# EAGLE board Compute Module (EAGLE 9.6.2), part 1 of 2
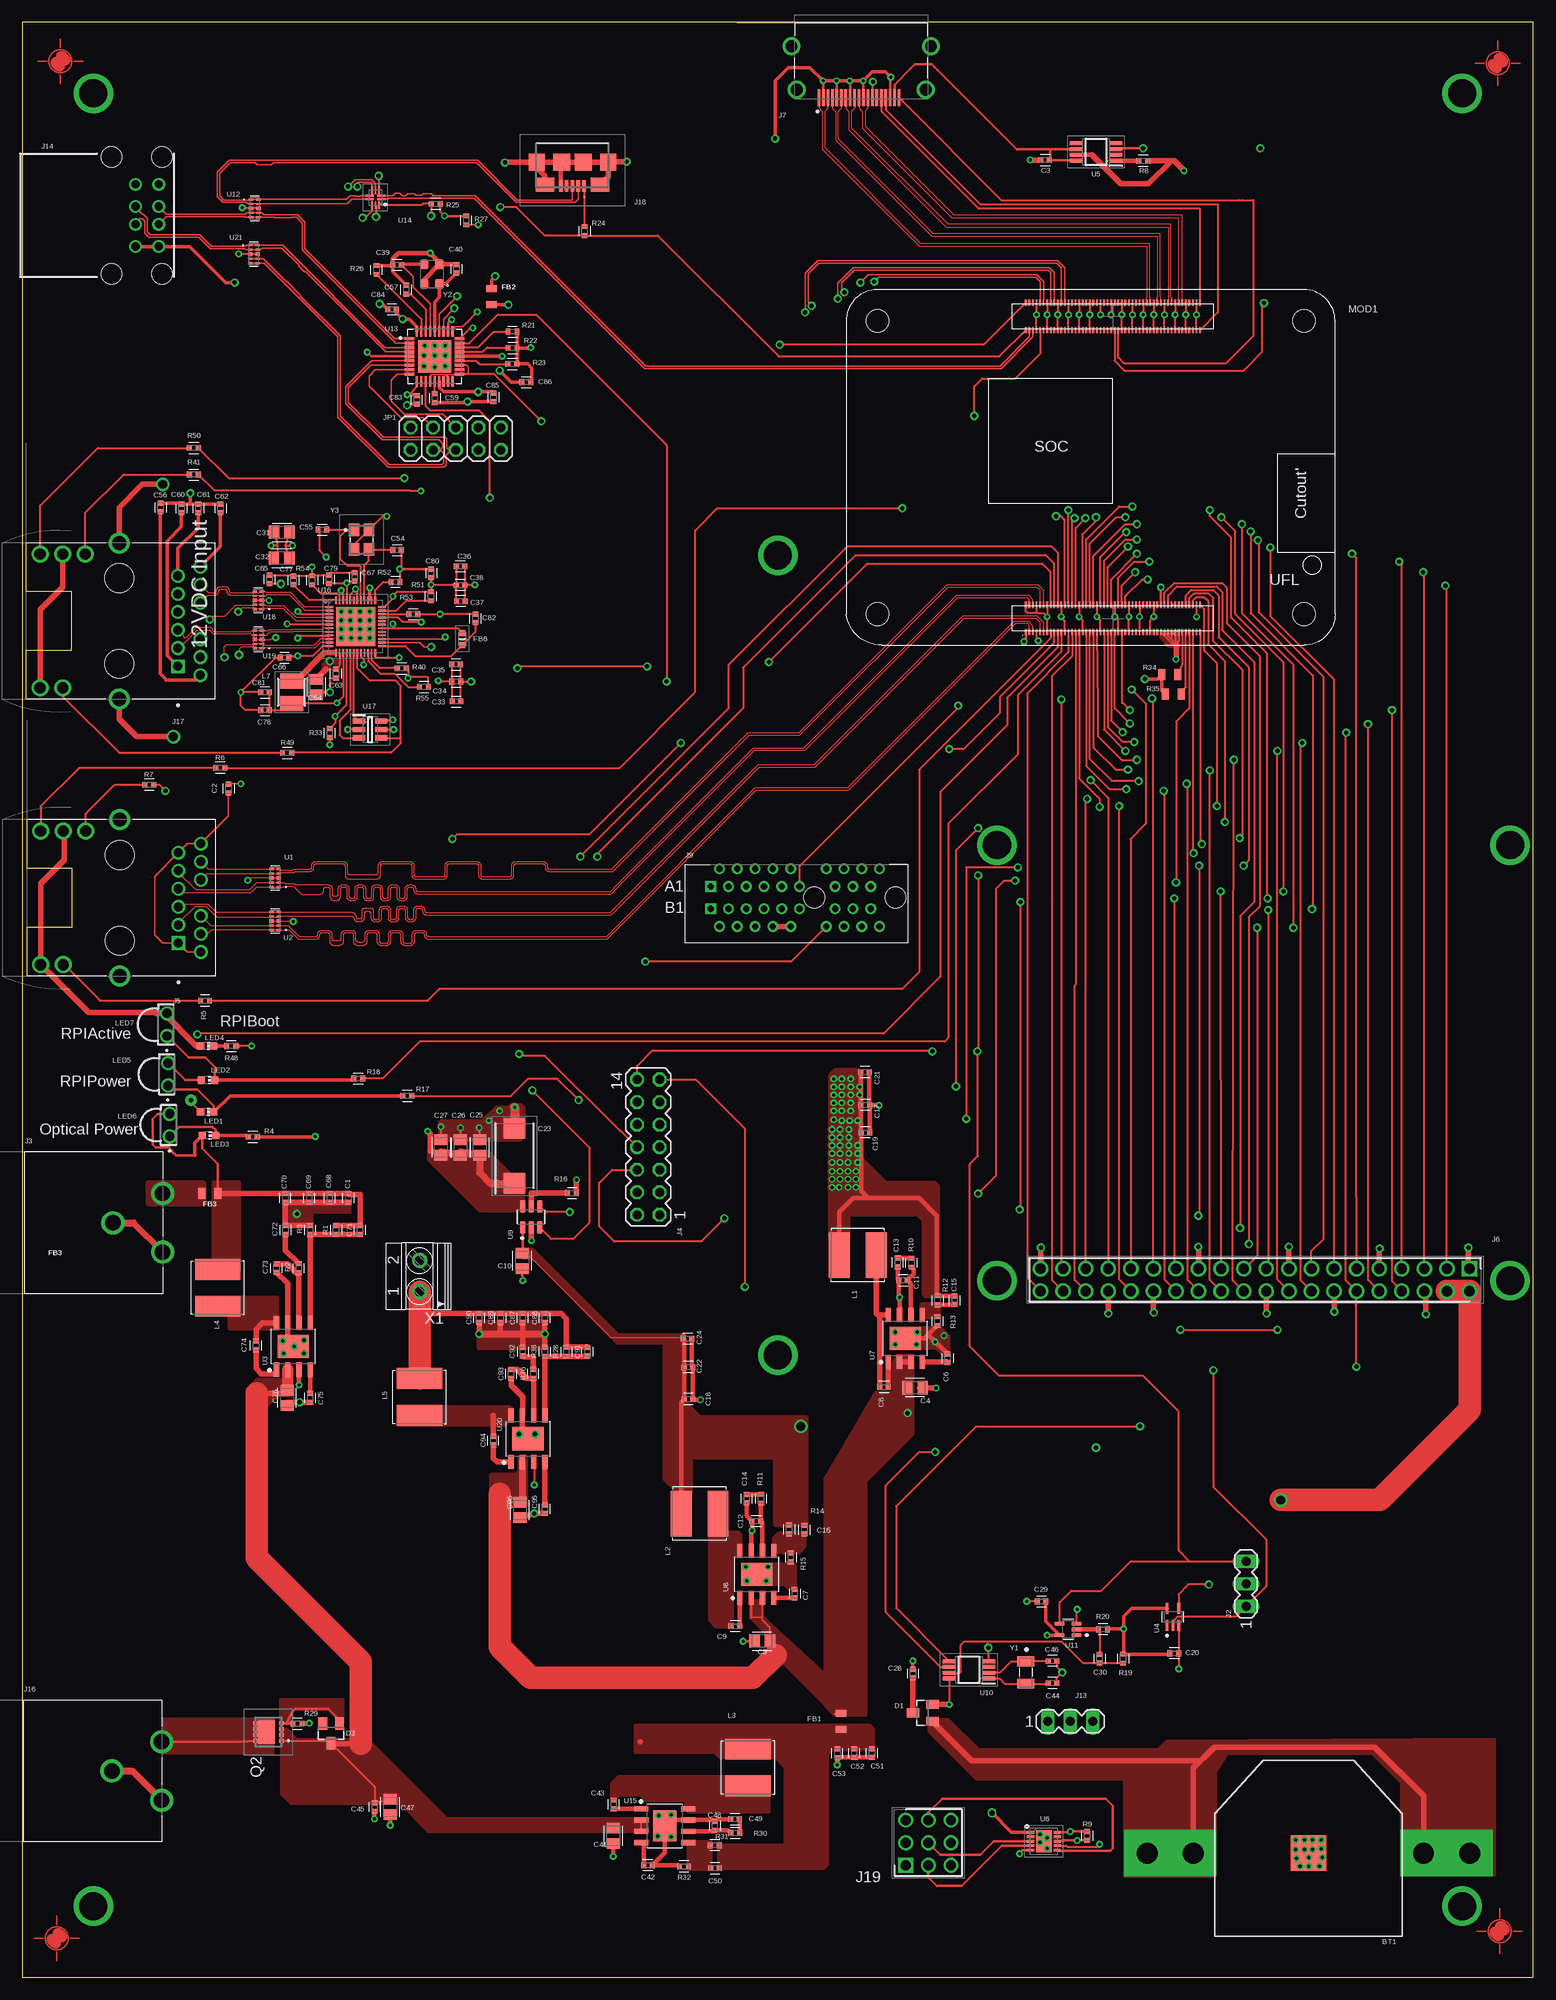
[diagram p11: board, top side]
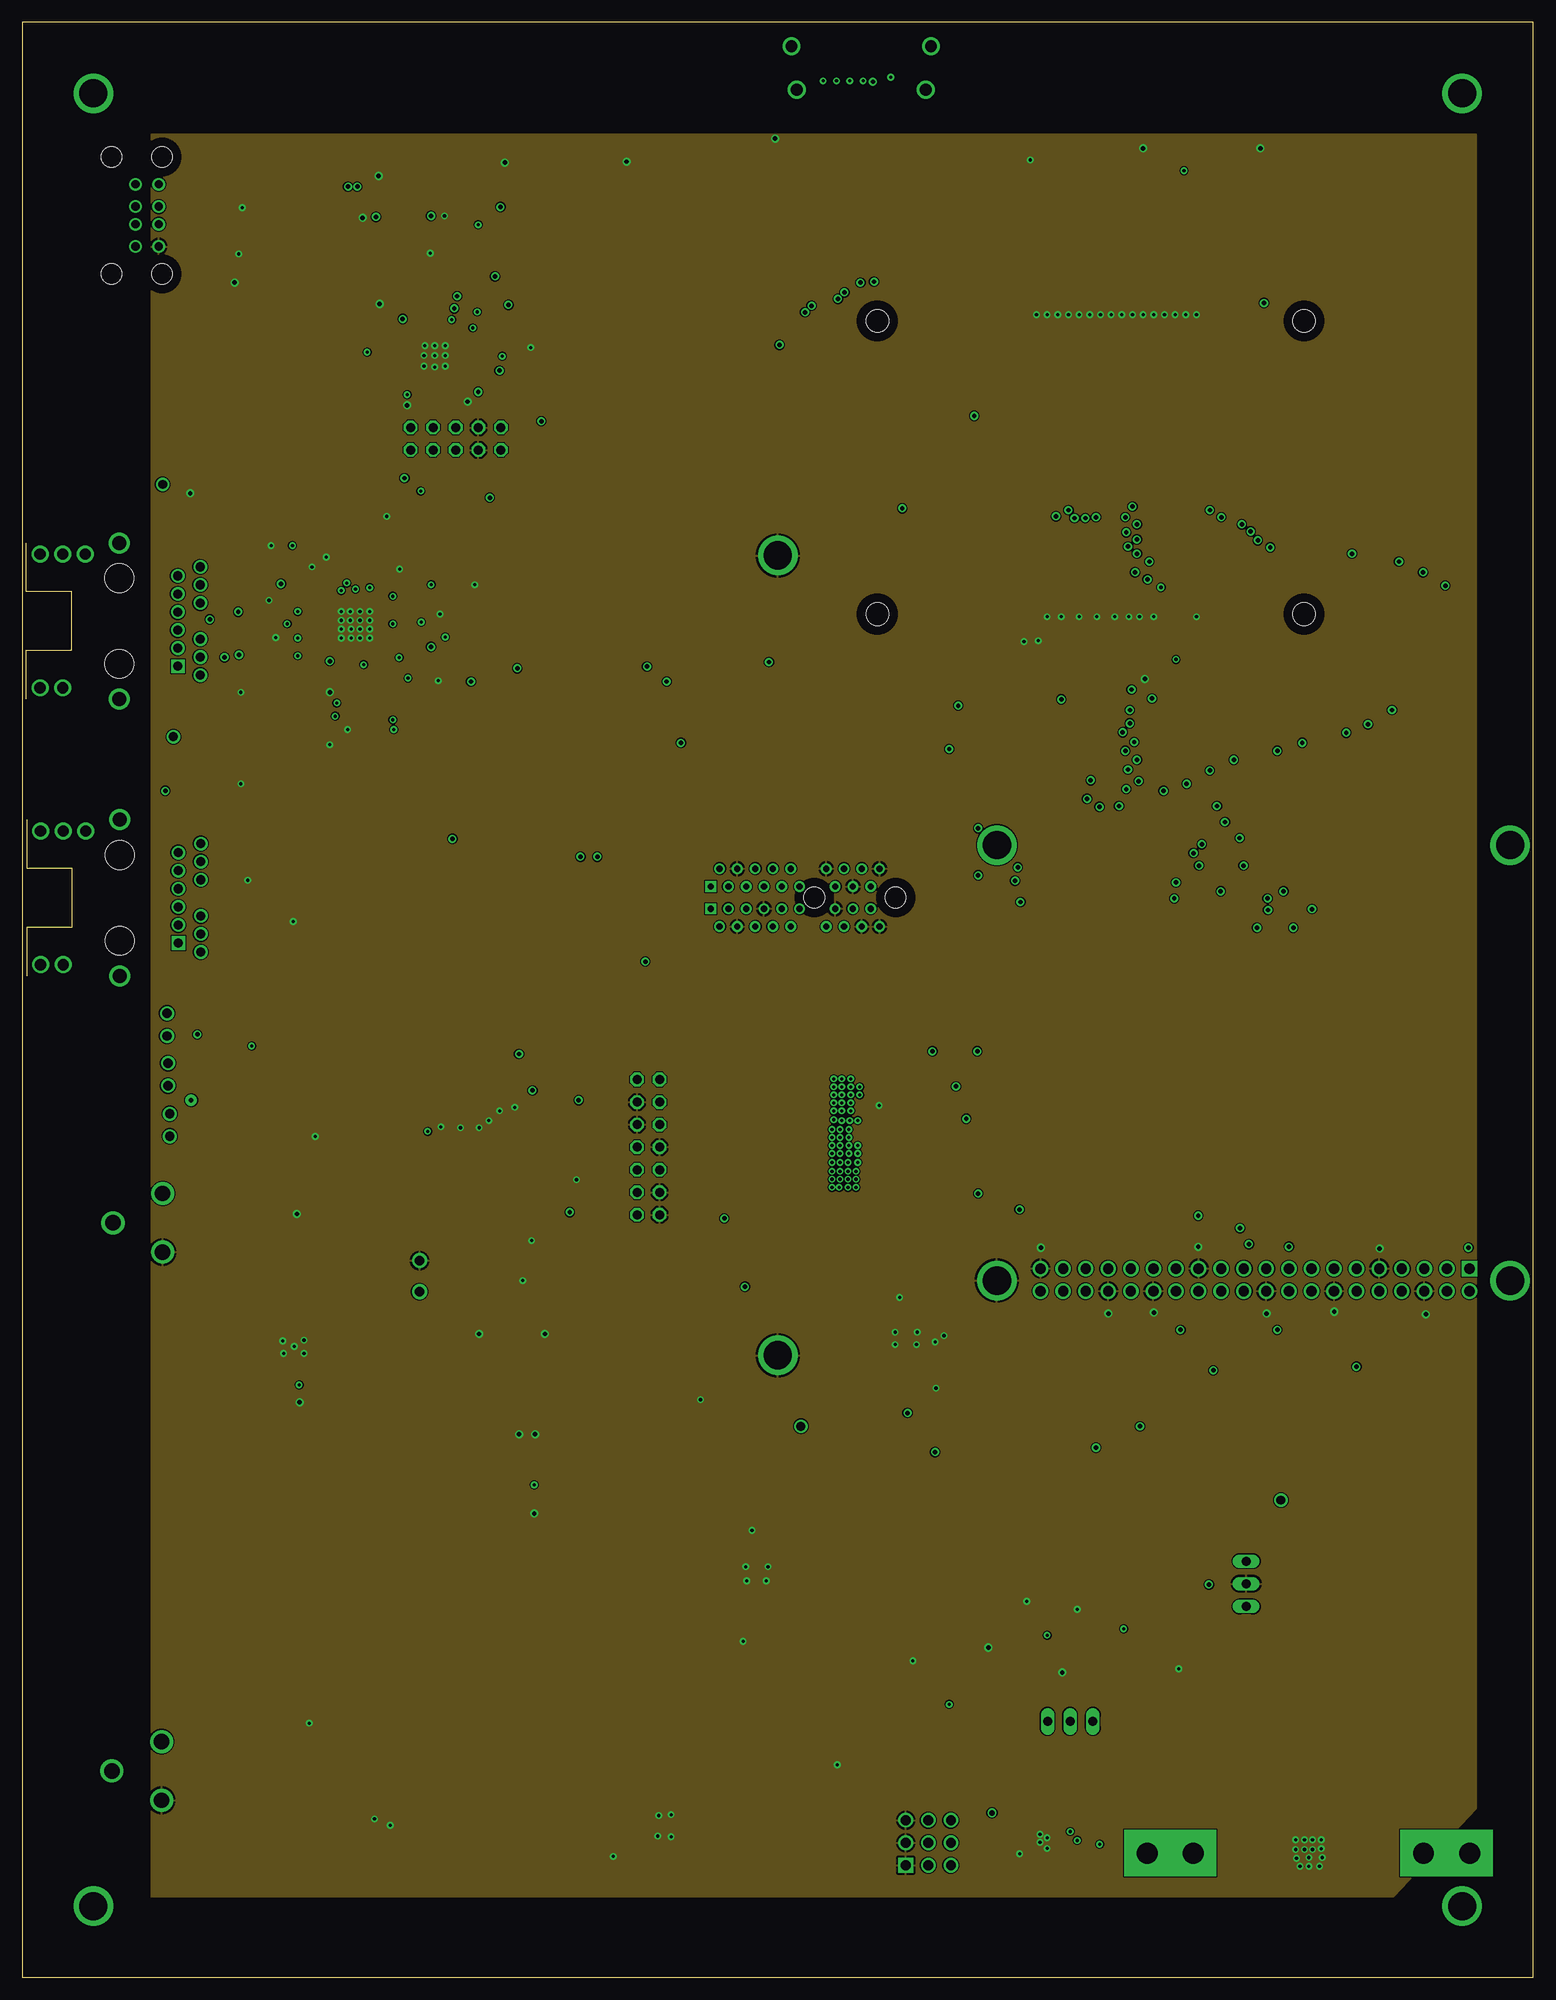
[diagram p12: board, inner layer GND]
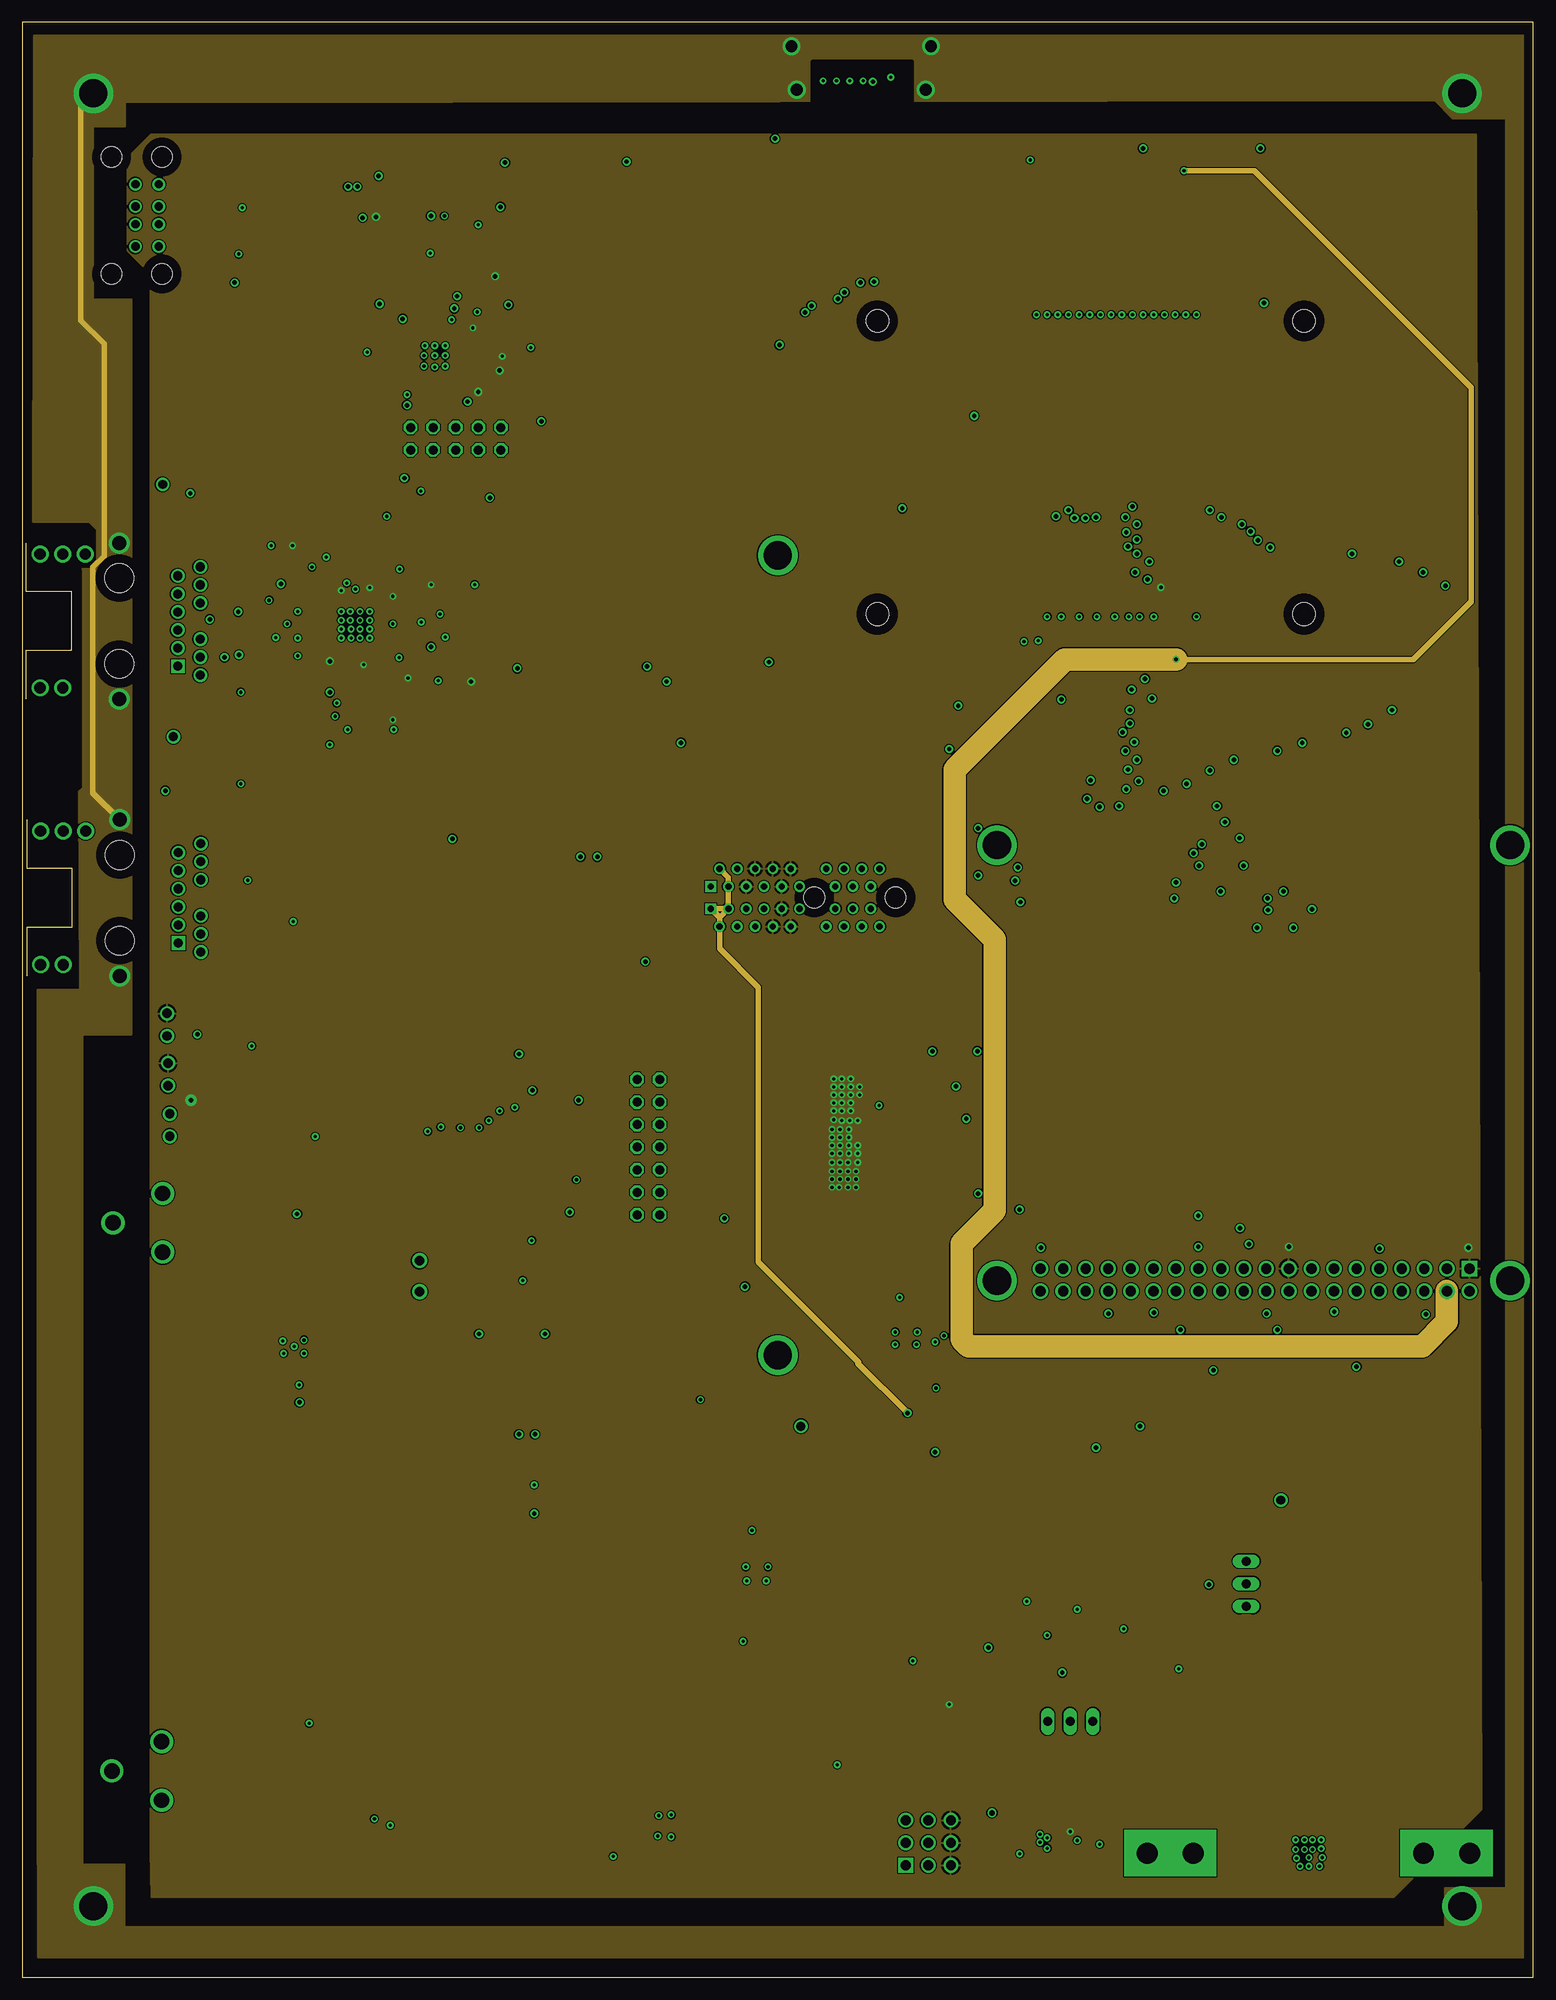
[diagram p13: board, inner layer 3v3]
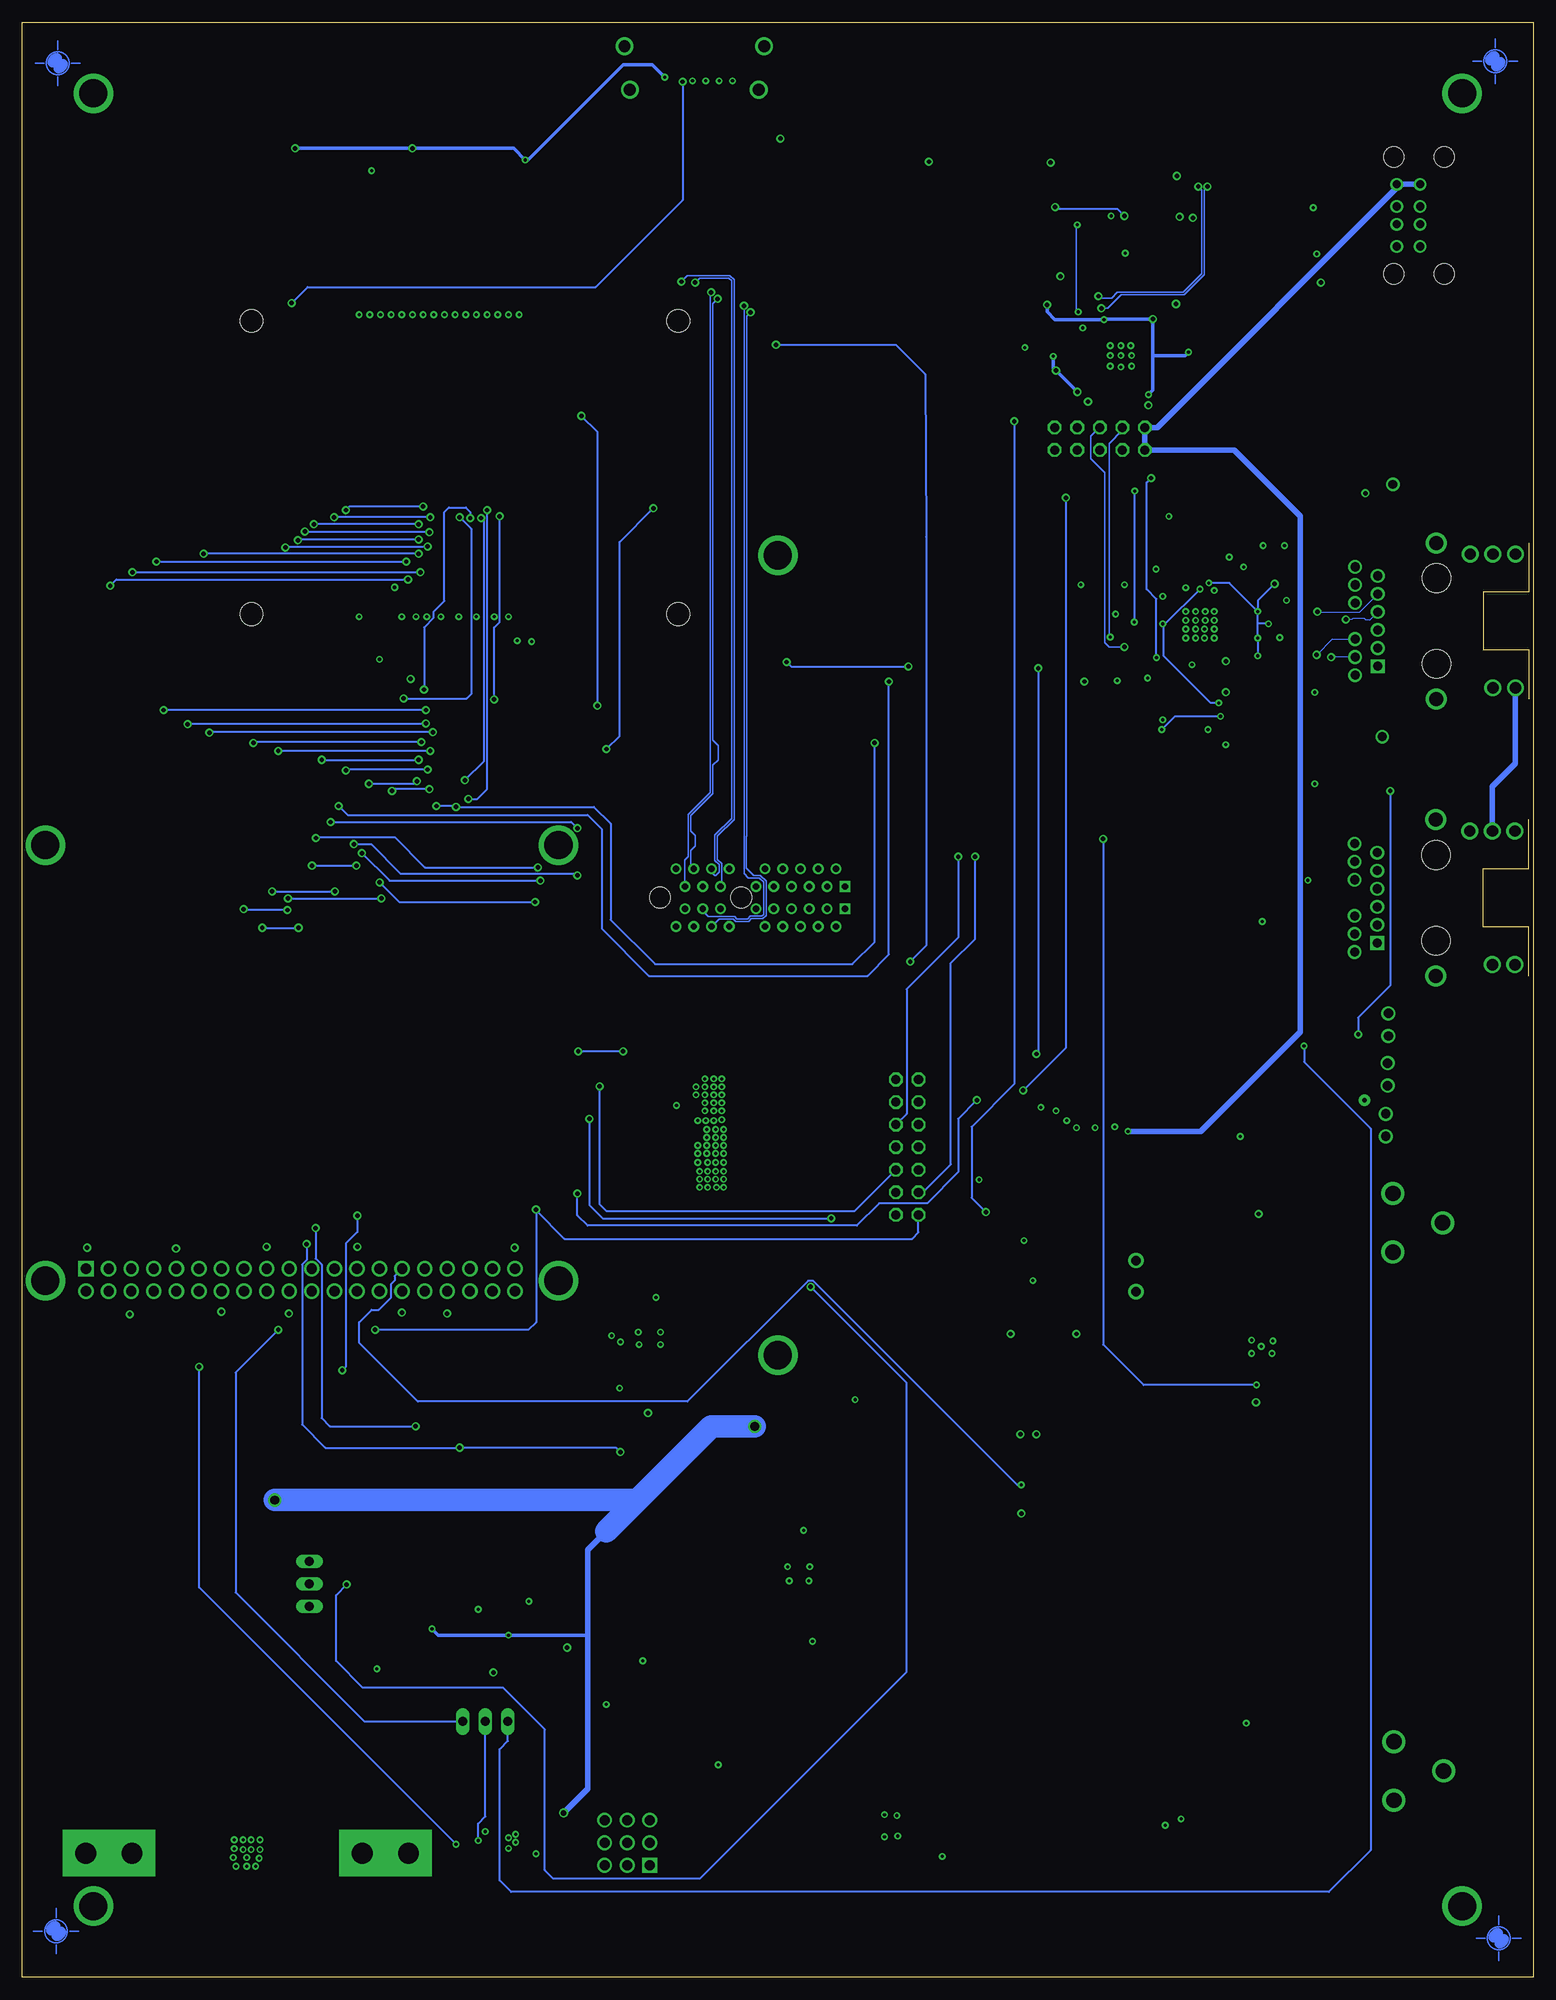
[diagram p14: board, bottom side, seen from below]

Size 170 x 220 mm. Coordinates in mm from the lower left corner, seen from the top.
Outline: 0,0 170,0 170,220 0,220 0,0
Copper layers (1*2+15*16): Top 0.035mm / dielectric 0.09mm / GND 0.035mm / dielectric 1.26mm / 3v3 0.035mm / dielectric 0.09mm / Bottom 0.035mm
Design rules "default *": minimum track width 5mil, minimum drill 0.35mm, track to track 5mil, track to pad 5mil, pad to pad 5mil, via to via 5mil, smd to smd 5mil, copper to edge 40mil, drill to drill 5mil, minimum pad ring 10mil, minimum via ring 8mil, stop-mask expansion 2mil, vias tented up to drill 0mil, thermal gap 10mil
Net classes: 1 Ethernet 100: width 0.127 mm, clearance 0.13 mm; 2 USB 90: width 0.147 mm, clearance 0.13 mm; 3 PCI 90: width 0.147 mm, clearance 0.13 mm; 4 HDMI 100: width 0.127 mm, clearance 0.13 mm

## Footprints (pad centres in the part's own frame; a part is rotated, then mirrored left to right if it is on the bottom)
EDGE-LIBRARY_79523141 = smd 4 x 4: N 0,0 | drill 2.35 pad 5.2 square: P1 -12.95,0; P2 12.95,0; P3 18.15,0; P4 -18.15,0
EDGE-LIBRARY_TUTORIAL---FUSION-360_CAPC1005X60 = smd 0.56 x 0.629: 1 -0.485,0; 2 0.485,0
EDGE-LIBRARY_TUTORIAL---FUSION-360_CAPC2012X110 = smd 1.165 x 1.465: 1 -0.875,0; 2 0.875,0
CAPPM7343X200N = smd 2.3 x 2.45: 1 -3.1,0; 2 3.1,0
EDGE-LIBRARY_SOT23 = smd 1 x 1.4: 1 -0.95,-1.1; 2 0.95,-1.1; 3 0,1.1
EDGE-LIBRARY_0805 = smd 0.8 x 1.2: 1 -0.9,0; 2 0.9,0
SAMACSYS_PARTS_BLM18AG102BH1D = smd 0.65 x 0.7: 1 -0.675,0; 2 0.675,0
CON-LSTB_MA03-1 = drill 1.016 long: 1 -2.54,0; 2 0,0; 3 2.54,0
L712RAS_SWITCHCRAFT_L712RAS = drill 1.727: C 0,3.302; S -5.588,0; SS 0,-3.302
CON-LSTB_MA07-2 = drill 1.016 octagon: 1 -7.62,-1.27; 2 -7.62,1.27; 3 -5.08,-1.27; 4 -5.08,1.27; 5 -2.54,-1.27; 6 -2.54,1.27; 7 0,-1.27; 8 0,1.27; 9 2.54,-1.27; 10 2.54,1.27; 11 5.08,-1.27; 12 5.08,1.27; 13 7.62,-1.27; 14 7.62,1.27
EDGE-LIBRARY_L836-1J1T-43_BEL_L836-1J1T-43 = drill 1.02 square: 1 -5.08,-6.604 | drill 1.02: 2 -3.048,-6.604; 3 -1.016,-6.604; 4 1.016,-6.604; 5 3.048,-6.604; 6 5.08,-6.604; 7 -6.096,-9.144; 8 -4.064,-9.144; 9 -2.032,-9.144; 10 2.032,-9.144; 11 4.064,-9.144; 12 6.096,-9.144 | drill 1.27: 13 -7.518,6.35; 14 -7.518,8.89; 15 7.518,3.81; 16 7.518,6.35; 17 7.518,8.89 | drill 1.57: S1 -8.788,0; S2 8.788,0 | hole 3.251: -4.826,0; 4.826,0
HDRV40W67P254_2X20_5080X483X85 = drill 1.15 pad 1.725 square: 1 0,0 | drill 1.15 pad 1.725: 2 0,2.54; 3 2.54,0; 4 2.54,2.54; 5 5.08,0; 6 5.08,2.54; 7 7.62,0; 8 7.62,2.54; 9 10.16,0; 10 10.16,2.54; 11 12.7,0; 12 12.7,2.54; 13 15.24,0; 14 15.24,2.54; 15 17.78,0; 16 17.78,2.54; 17 20.32,0; 18 20.32,2.54; 19 22.86,0; 20 22.86,2.54; 21 25.4,0; 22 25.4,2.54; 23 27.94,0; 24 27.94,2.54; 25 30.48,0; 26 30.48,2.54; 27 33.02,0; 28 33.02,2.54; 29 35.56,0; 30 35.56,2.54; 31 38.1,0; 32 38.1,2.54; 33 40.64,0; 34 40.64,2.54; 35 43.18,0; 36 43.18,2.54; 37 45.72,0; 38 45.72,2.54; 39 48.26,0; 40 48.26,2.54
EDGE-LIBRARY_STEWART_SS-53000-001 = smd 0.3 x 1.9: 1 4.75,0; 2 4.25,0; 3 3.75,0; 4 3.25,0; 5 2.75,0; 6 2.25,0; 7 1.75,0; 8 1.25,0; 9 0.75,0; 10 0.25,0; 11 -0.25,0; 12 -0.75,0; 13 -1.25,0; 14 -1.75,0; 15 -2.25,0; 16 -2.75,0; 17 -3.25,0; 18 -3.75,0; 19 -4.25,0 | drill 1.33: S1 7.25,-0.9; S2 -7.25,-0.9; S3 -7.85,-5.8; S4 7.85,-5.8
EDGE-LIBRARY_AMPHENOL_10018784-10210TLF = drill 0.7 square: A1 -11.65,1.25; B1 -11.65,-1.25 | drill 0.7: A2 -10.65,3.25; A3 -9.65,1.25; A4 -8.65,3.25; A5 -7.65,1.25; A6 -6.65,3.25; A7 -5.65,1.25; A8 -4.65,3.25; A9 -3.65,1.25; A10 -2.65,3.25; A11 -1.65,1.25; A12 1.35,3.25; A13 2.35,1.25; A14 3.35,3.25; A15 4.35,1.25; A16 5.35,3.25; A17 6.35,1.25; A18 7.35,3.25; B2 -10.65,-3.25; B3 -9.65,-1.25; B4 -8.65,-3.25; B5 -7.65,-1.25; B6 -6.65,-3.25; B7 -5.65,-1.25; B8 -4.65,-3.25; B9 -3.65,-1.25; B10 -2.65,-3.25; B11 -1.65,-1.25; B12 1.35,-3.25; B13 2.35,-1.25; B14 3.35,-3.25; B15 4.35,-1.25; B16 5.35,-3.25; B17 6.35,-1.25; B18 7.35,-3.25 | hole 2.35: 0,0; 9.15,0
EDGE-LIBRARY_67298-4090_MOLEX_67298-4090 = drill 0.92: 1 -3.5,5.33; 2 -1,5.33; 3 1,5.33; 4 3.5,5.33; 5 -3.5,2.71; 6 -1,2.71; 7 1,2.71; 8 3.5,2.71 | hole 2.3: -6.57,5.68; -6.57,0; 6.57,5.68; 6.57,0
ZX62B5PA33 = smd 0.4 x 1.35: 1 -1.3,2.325; 2 -0.65,2.325; 3 0,2.325; 4 0.65,2.325; 5 1.3,2.325 | smd 1.8 x 1.9: MP1 -4,-0.35; MP2 4,-0.35 | smd 2.1 x 1.6: MP3 -3.1,2.2; MP4 3.1,2.2 | smd 1.9 x 1.9: MP5 -1.2,-0.35; MP6 1.2,-0.35
HDRV9W64P254_3X3_762X749X838P = drill 1.1 pad 1.65 square: 1 0,0 | drill 1.1 pad 1.65: 2 0,2.54; 3 0,5.08; 4 2.54,0; 5 2.54,2.54; 6 2.54,5.08; 7 5.08,0; 8 5.08,2.54; 9 5.08,5.08
2X05 = drill 1.016 octagon: 1 -5.08,-1.27; 2 -5.08,1.27; 3 -2.54,-1.27; 4 -2.54,1.27; 5 0,-1.27; 6 0,1.27; 7 2.54,-1.27; 8 2.54,1.27; 9 5.08,-1.27; 10 5.08,1.27
EDGE-LIBRARY_SRN6045TA-3R3Y_IND_SRN6045TA-3R3Y = smd 2.35 x 5.1: 1 -2.075,0; 2 2.075,0
INDPM3030X150N = smd 1.7 x 2.6: 1 -1.25,0; 2 1.25,0
LED_CHIP-LED0603 = smd 0.8 x 0.8: A 0,-0.75; C 0,0.75
TLPP5600 = drill 1.05 pad 1.55: 1 1.27,-0.7; 2 -1.27,-0.7
BEAGLEBONEBLACK_MOUNTING_HOLE = drill 3.175 pad 4.445: P$1 0,0
EDGE-LIBRARY_RPI-CM4 = smd 0.2 x 0.7: 1 34.8,38.54; 2 34.8,35.46; 3 34.4,38.54; 4 34.4,35.46; 5 34,38.54; 6 34,35.46; 7 33.6,38.54; 8 33.6,35.46; 9 33.2,38.54; 10 33.2,35.46; 11 32.8,38.54; 12 32.8,35.46; 13 32.4,38.54; 14 32.4,35.46; 15 32,38.54; 16 32,35.46; 17 31.6,38.54; 18 31.6,35.46; 19 31.2,38.54; 20 31.2,35.46; 21 30.8,38.54; 22 30.8,35.46; 23 30.4,38.54; 24 30.4,35.46; 25 30,38.54; 26 30,35.46; 27 29.6,38.54; 28 29.6,35.46; 29 29.2,38.54; 30 29.2,35.46; 31 28.8,38.54; 32 28.8,35.46; 33 28.4,38.54; 34 28.4,35.46; 35 28,38.54; 36 28,35.46; 37 27.6,38.54; 38 27.6,35.46; 39 27.2,38.54; 40 27.2,35.46; 41 26.8,38.54; 42 26.8,35.46; 43 26.4,38.54; 44 26.4,35.46; 45 26,38.54; 46 26,35.46; 47 25.6,38.54; 48 25.6,35.46; 49 25.2,38.54; 50 25.2,35.46; 51 24.8,38.54; 52 24.8,35.46; 53 24.4,38.54; 54 24.4,35.46; 55 24,38.54; 56 24,35.46; 57 23.6,38.54; 58 23.6,35.46; 59 23.2,38.54; 60 23.2,35.46; 61 22.8,38.54; 62 22.8,35.46; 63 22.4,38.54; 64 22.4,35.46; 65 22,38.54; 66 22,35.46; 67 21.6,38.54; 68 21.6,35.46; 69 21.2,38.54; 70 21.2,35.46; 71 20.8,38.54; 72 20.8,35.46; 73 20.4,38.54; 74 20.4,35.46; 75 20,38.54; 76 20,35.46; 77 19.6,38.54; 78 19.6,35.46; 79 19.2,38.54; 80 19.2,35.46; 81 18.8,38.54; 82 18.8,35.46; 83 18.4,38.54; 84 18.4,35.46; 85 18,38.54; 86 18,35.46; 87 17.6,38.54; 88 17.6,35.46; 89 17.2,38.54; 90 17.2,35.46; 91 16.8,38.54; 92 16.8,35.46; 93 16.4,38.54; 94 16.4,35.46; 95 16,38.54; 96 16,35.46; 97 15.6,38.54; 98 15.6,35.46; 99 15.2,38.54; 100 15.2,35.46; 101 34.8,4.54; 102 34.8,1.46; 103 34.4,4.54; 104 34.4,1.46; 105 34,4.54; 106 34,1.46; 107 33.6,4.54; 108 33.6,1.46; 109 33.2,4.54; 110 33.2,1.46; 111 32.8,4.54; 112 32.8,1.46; 113 32.4,4.54; 114 32.4,1.46; 115 32,4.54; 116 32,1.46; 117 31.6,4.54; 118 31.6,1.46; 119 31.2,4.54; 120 31.2,1.46; 121 30.8,4.54; 122 30.8,1.46; 123 30.4,4.54; 124 30.4,1.46; 125 30,4.54; 126 30,1.46; 127 29.6,4.54; 128 29.6,1.46; 129 29.2,4.54; 130 29.2,1.46; 131 28.8,4.54; 132 28.8,1.46; 133 28.4,4.54; 134 28.4,1.46; 135 28,4.54; 136 28,1.46; 137 27.6,4.54; 138 27.6,1.46; 139 27.2,4.54; 140 27.2,1.46; 141 26.8,4.54; 142 26.8,1.46; 143 26.4,4.54; 144 26.4,1.46; 145 26,4.54; 146 26,1.46; 147 25.6,4.54; 148 25.6,1.46; 149 25.2,4.54; 150 25.2,1.46; 151 24.8,4.54; 152 24.8,1.46; 153 24.4,4.54; 154 24.4,1.46; 155 24,4.54; 156 24,1.46; 157 23.6,4.54; 158 23.6,1.46; 159 23.2,4.54; 160 23.2,1.46; 161 22.8,4.54; 162 22.8,1.46; 163 22.4,4.54; 164 22.4,1.46; 165 22,4.54; 166 22,1.46; 167 21.6,4.54; 168 21.6,1.46; 169 21.2,4.54; 170 21.2,1.46; 171 20.8,4.54; 172 20.8,1.46; 173 20.4,4.54; 174 20.4,1.46; 175 20,4.54; 176 20,1.46; 177 19.6,4.54; 178 19.6,1.46; 179 19.2,4.54; 180 19.2,1.46; 181 18.8,4.54; 182 18.8,1.46; 183 18.4,4.54; 184 18.4,1.46; 185 18,4.54; 186 18,1.46; 187 17.6,4.54; 188 17.6,1.46; 189 17.2,4.54; 190 17.2,1.46; 191 16.8,4.54; 192 16.8,1.46; 193 16.4,4.54; 194 16.4,1.46; 195 16,4.54; 196 16,1.46; 197 15.6,4.54; 198 15.6,1.46; 199 15.2,4.54; 200 15.2,1.46 | hole 2.55: 3.5,3.5; 3.5,36.5; 51.5,36.5; 51.5,3.5
RQ3E100ATTB = smd 0.47 x 0.5: 1 -0.975,-1.45; 2 -0.325,-1.45; 3 0.325,-1.45; 4 0.975,-1.45 | smd 0.47 x 0.55: 5 0.975,1.425; 6 0.325,1.425; 7 -0.325,1.425; 8 -0.975,1.425 | smd 2.7 x 1.85: 9 0,0.225
EDGE-LIBRARY_TUTORIAL---FUSION-360_RESC1005X40 = smd 0.535 x 0.644: 1 -0.507,0; 2 0.507,0
EDGE-LIBRARY_TPD4EUSB30DQAR_IC_TPD4EUSB30DQAR = smd 0.565 x 0.2: 1 -0.417,1; 2 -0.417,0.5; 4 -0.417,-0.5; 5 -0.417,-1; 6 0.417,-1; 7 0.417,-0.5; 9 0.417,0.5; 10 0.417,1 | smd 0.565 x 0.4: 3 -0.417,0; 8 0.417,0
EDGE-LIBRARY_AP64501_SOIC127P600X265-9T261X350N = smd 1.58 x 0.589: 1 -2.625,1.905; 2 -2.625,0.635; 3 -2.625,-0.635; 4 -2.625,-1.905; 5 2.625,-1.905; 6 2.625,-0.635; 7 2.625,0.635; 8 2.625,1.905 | smd 2.613 x 3.502: 9 0,0
EDGE-LIBRARY_SOT65P210X110-5N = smd 1.19 x 0.4: 1 -0.96,0.65; 2 -0.96,0; 3 -0.96,-0.65; 4 0.96,-0.65; 5 0.96,0.65
SOP65P490X110-8N = smd 1.45 x 0.45: 1 -2.225,0.975; 2 -2.225,0.325; 3 -2.225,-0.325; 4 -2.225,-0.975; 5 2.225,-0.975; 6 2.225,-0.325; 7 2.225,0.325; 8 2.225,0.975
SAMACSYS_PARTS_SON50P300X300X100-11N = smd 0.8 x 0.3: 1 -1.5,1; 2 -1.5,0.5; 3 -1.5,0; 4 -1.5,-0.5; 5 -1.5,-1; 6 1.5,-1; 7 1.5,-0.5; 8 1.5,0; 9 1.5,0.5; 10 1.5,1 | smd 1.75 x 2.5: 11 0,0
EDGE-LIBRARY_SOT95P280X140-6N = smd 1.35 x 0.6: 1 -1.185,0.95; 2 -1.185,0; 3 -1.185,-0.95; 4 1.185,-0.95; 5 1.185,0; 6 1.185,0.95
EDGE-LIBRARY_USB2514B-I_M2_QFN50P600X600X100-37N = smd 1.1 x 0.26: 1 -2.815,2; 2 -2.815,1.5; 3 -2.815,1; 4 -2.815,0.5; 5 -2.815,0; 6 -2.815,-0.5; 7 -2.815,-1; 8 -2.815,-1.5; 9 -2.815,-2; 19 2.815,-2; 20 2.815,-1.5; 21 2.815,-1; 22 2.815,-0.5; 23 2.815,0; 24 2.815,0.5; 25 2.815,1; 26 2.815,1.5; 27 2.815,2 | smd 0.26 x 1.1: 10 -2,-2.815; 11 -1.5,-2.815; 12 -1,-2.815; 13 -0.5,-2.815; 14 0,-2.815; 15 0.5,-2.815; 16 1,-2.815; 17 1.5,-2.815; 18 2,-2.815; 28 2,2.815; 29 1.5,2.815; 30 1,2.815; 31 0.5,2.815; 32 0,2.815; 33 -0.5,2.815; 34 -1,2.815; 35 -1.5,2.815; 36 -2,2.815 | smd 3.7 x 3.7: 37 0,0
QFN40P140X180X55-10N = smd 0.9 x 0.2: 1 -0.65,0.2; 2 -0.65,-0.2; 6 0.65,-0.2; 7 0.65,0.2 | smd 0.2 x 0.9: 3 -0.4,-0.85; 4 0,-0.85; 5 0.4,-0.85; 8 0.4,0.85; 9 0,0.85; 10 -0.4,0.85
QFN40P600X600X90-49N = smd 0.85 x 0.2: 1 -2.95,2.2; 2 -2.95,1.8; 3 -2.95,1.4; 4 -2.95,1; 5 -2.95,0.6; 6 -2.95,0.2; 7 -2.95,-0.2; 8 -2.95,-0.6; 9 -2.95,-1; 10 -2.95,-1.4; 11 -2.95,-1.8; 12 -2.95,-2.2; 25 2.95,-2.2; 26 2.95,-1.8; 27 2.95,-1.4; 28 2.95,-1; 29 2.95,-0.6; 30 2.95,-0.2; 31 2.95,0.2; 32 2.95,0.6; 33 2.95,1; 34 2.95,1.4; 35 2.95,1.8; 36 2.95,2.2 | smd 0.2 x 0.85: 13 -2.2,-2.95; 14 -1.8,-2.95; 15 -1.4,-2.95; 16 -1,-2.95; 17 -0.6,-2.95; 18 -0.2,-2.95; 19 0.2,-2.95; 20 0.6,-2.95; 21 1,-2.95; 22 1.4,-2.95; 23 1.8,-2.95; 24 2.2,-2.95; 37 2.2,2.95; 38 1.8,2.95; 39 1.4,2.95; 40 1,2.95; 41 0.6,2.95; 42 0.2,2.95; 43 -0.2,2.95; 44 -0.6,2.95; 45 -1,2.95; 46 -1.4,2.95; 47 -1.8,2.95; 48 -2.2,2.95 | smd 4.4 x 4.4: 49 0,0
SAMACSYS_PARTS_SOT95P270X145-6N = smd 1.4 x 0.6: 1 -1.25,0.95; 2 -1.25,0; 3 -1.25,-0.95; 4 1.25,-0.95; 5 1.25,0; 6 1.25,0.95
1751248 = drill 1.1 pad 1.7: 1 -1.75,-0.1; 2 1.75,-0.1
XTAL_ECS-.327-12.5-34R-TR = smd 1.1 x 1.9: 1 -1.25,0; 2 1.25,0
EDGE-LIBRARY_ABM8-24.000MHZ-B2-T_OSCSC320X250X100N = smd 0.98 x 1.1: 1 -0.85,1.1; 2 -0.85,-1.1; 3 0.85,-1.1; 4 0.85,1.1
SAMACSYS_PARTS_ABM8G48000MHZ18D2YT = smd 1.4 x 1.2: 1 -1.1,-0.85; 2 1.1,-0.85; 3 1.1,0.85; 4 -1.1,0.85

## Placement (x,y rotation side)
BT1  EDGE-LIBRARY_BATTERY_HOLDER  [EDGE-LIBRARY_79523141]  144.7,13.97 180 top
C1  22uF  [EDGE-LIBRARY_TUTORIAL---FUSION-360_CAPC1005X60]  36.7,87.7 270 top
C2  0.1uF  [EDGE-LIBRARY_TUTORIAL---FUSION-360_CAPC1005X60]  23.2,133.77 90 top
C3  0.1uF  [EDGE-LIBRARY_TUTORIAL---FUSION-360_CAPC1005X60]  115.08,204.5 180 top
C4  10uF  [EDGE-LIBRARY_TUTORIAL---FUSION-360_CAPC2012X110]  100.44,66.35 0 top
C5  10uF  [EDGE-LIBRARY_TUTORIAL---FUSION-360_CAPC2012X110]  83.24,37.85 180 top
C6  10000pF  [EDGE-LIBRARY_TUTORIAL---FUSION-360_CAPC1005X60]  104.1,69.66 90 top
C7  10000pF  [EDGE-LIBRARY_TUTORIAL---FUSION-360_CAPC1005X60]  86.9,43.17 90 top
C8  0.1uF  [EDGE-LIBRARY_TUTORIAL---FUSION-360_CAPC1005X60]  96.97,66.4 0 top
C9  0.1uF  [EDGE-LIBRARY_TUTORIAL---FUSION-360_CAPC1005X60]  80.22,39.5 0 top
C10  10uF  [EDGE-LIBRARY_TUTORIAL---FUSION-360_CAPC2012X110]  56.25,80.62 270 top
C11  56pF  [EDGE-LIBRARY_TUTORIAL---FUSION-360_CAPC1005X60]  99.1,78.45 180 top
C12  33pF  [EDGE-LIBRARY_TUTORIAL---FUSION-360_CAPC1005X60]  82.58,51.35 180 top
C13  2700pF  [EDGE-LIBRARY_TUTORIAL---FUSION-360_CAPC1005X60]  98.5,80.44 270 top
C14  2700pF  [EDGE-LIBRARY_TUTORIAL---FUSION-360_CAPC1005X60]  81.5,53.86 270 top
C15  DNP  [EDGE-LIBRARY_TUTORIAL---FUSION-360_CAPC1005X60]  104.9,76.18 270 top
C16  DNP  [EDGE-LIBRARY_TUTORIAL---FUSION-360_CAPC1005X60]  88,50.36 270 top
C17  22uF  [EDGE-LIBRARY_TUTORIAL---FUSION-360_CAPC1005X60]  94.84,98.15 0 top
C18  22uF  [EDGE-LIBRARY_TUTORIAL---FUSION-360_CAPC1005X60]  74.96,65.05 0 top
C19  22uF  [EDGE-LIBRARY_TUTORIAL---FUSION-360_CAPC1005X60]  94.88,95.05 0 top
C20  22uF  [EDGE-LIBRARY_TUTORIAL---FUSION-360_CAPC1005X60]  129.6,36.45 0 top
C21  22uF  [EDGE-LIBRARY_TUTORIAL---FUSION-360_CAPC1005X60]  94.82,101.85 0 top
C22  22uF  [EDGE-LIBRARY_TUTORIAL---FUSION-360_CAPC1005X60]  74.94,68.65 0 top
C23  100uF  [CAPPM7343X200N]  55.37,92.45 90 top
C24  22uF  [EDGE-LIBRARY_TUTORIAL---FUSION-360_CAPC1005X60]  74.86,71.85 0 top
C25  10uF  [EDGE-LIBRARY_TUTORIAL---FUSION-360_CAPC2012X110]  51.45,93.38 90 top
C26  10uF  [EDGE-LIBRARY_TUTORIAL---FUSION-360_CAPC2012X110]  49.3,93.36 90 top
C27  10uF  [EDGE-LIBRARY_TUTORIAL---FUSION-360_CAPC2012X110]  47.1,93.38 90 top
C28  0.1uF  [EDGE-LIBRARY_TUTORIAL---FUSION-360_CAPC1005X60]  100.2,34.17 90 top
C29  0.1uF  [EDGE-LIBRARY_TUTORIAL---FUSION-360_CAPC1005X60]  114.68,42.3 180 top
C30  0.1uF  [EDGE-LIBRARY_TUTORIAL---FUSION-360_CAPC1005X60]  121.2,35.87 90 top
C31  10uF  [EDGE-LIBRARY_TUTORIAL---FUSION-360_CAPC2012X110]  29.2,162.6 180 top
C32  10uF  [EDGE-LIBRARY_TUTORIAL---FUSION-360_CAPC2012X110]  29.18,159.7 180 top
C33  0.1uF  [EDGE-LIBRARY_TUTORIAL---FUSION-360_CAPC1005X60]  48.84,143.56 180 top
C34  0.1uF  [EDGE-LIBRARY_TUTORIAL---FUSION-360_CAPC1005X60]  48.83,145.8 180 top
C35  0.1uF  [EDGE-LIBRARY_TUTORIAL---FUSION-360_CAPC1005X60]  48.81,147.75 180 top
C36  0.1uF  [EDGE-LIBRARY_TUTORIAL---FUSION-360_CAPC1005X60]  49.29,158.75 0 top
C37  0.1uF  [EDGE-LIBRARY_TUTORIAL---FUSION-360_CAPC1005X60]  49.34,154.85 0 top
C38  0.1uF  [EDGE-LIBRARY_TUTORIAL---FUSION-360_CAPC1005X60]  49.29,156.65 0 top
C39  27pF  [EDGE-LIBRARY_TUTORIAL---FUSION-360_CAPC1005X60]  42.16,192.7 180 top
C40  27pF  [EDGE-LIBRARY_TUTORIAL---FUSION-360_CAPC1005X60]  48.84,192.24 90 top
C41  10uF  [EDGE-LIBRARY_TUTORIAL---FUSION-360_CAPC2012X110]  66.5,15.92 270 top
C42  10000pF  [EDGE-LIBRARY_TUTORIAL---FUSION-360_CAPC1005X60]  70.38,12.6 0 top
C43  0.1uF  [EDGE-LIBRARY_TUTORIAL---FUSION-360_CAPC1005X60]  66.55,19.46 270 top
C44  10pF  [EDGE-LIBRARY_TUTORIAL---FUSION-360_CAPC1005X60]  115.9,33.1 0 top
C45  0.1uF  [EDGE-LIBRARY_TUTORIAL---FUSION-360_CAPC1005X60]  39.65,19.16 270 top
C46  12pF  [EDGE-LIBRARY_TUTORIAL---FUSION-360_CAPC1005X60]  115.9,35.6 0 top
C47  10uF  [EDGE-LIBRARY_TUTORIAL---FUSION-360_CAPC2012X110]  41.4,19.18 270 top
C48  15pF  [EDGE-LIBRARY_TUTORIAL---FUSION-360_CAPC1005X60]  77.9,17.04 90 top
C49  2700pF  [EDGE-LIBRARY_TUTORIAL---FUSION-360_CAPC1005X60]  80.18,17.8 180 top
C50  DNP  [EDGE-LIBRARY_TUTORIAL---FUSION-360_CAPC1005X60]  77.94,12.3 180 top
C51  22uF  [EDGE-LIBRARY_TUTORIAL---FUSION-360_CAPC1005X60]  95.6,25.24 270 top
C52  22uF  [EDGE-LIBRARY_TUTORIAL---FUSION-360_CAPC1005X60]  93.6,25.22 270 top
C53  22uF  [EDGE-LIBRARY_TUTORIAL---FUSION-360_CAPC1005X60]  91.7,25.2 270 top
C54  16pF  [EDGE-LIBRARY_TUTORIAL---FUSION-360_CAPC1005X60]  42.18,160.6 180 top
C55  16pF  [EDGE-LIBRARY_TUTORIAL---FUSION-360_CAPC1005X60]  33.76,162.9 180 top
C56  0.1uF  [EDGE-LIBRARY_TUTORIAL---FUSION-360_CAPC1005X60]  15.55,165.39 90 top
C57  0.1uF  [EDGE-LIBRARY_TUTORIAL---FUSION-360_CAPC1005X60]  43.2,189.9 270 top
C59  0.1uF  [EDGE-LIBRARY_TUTORIAL---FUSION-360_CAPC1005X60]  46.4,177.7 90 top
C60  0.1uF  [EDGE-LIBRARY_TUTORIAL---FUSION-360_CAPC1005X60]  17.9,165.3 90 top
C61  0.1uF  [EDGE-LIBRARY_TUTORIAL---FUSION-360_CAPC1005X60]  19.8,165.3 90 top
C62  0.1uF  [EDGE-LIBRARY_TUTORIAL---FUSION-360_CAPC1005X60]  22.3,165.3 90 top
C63  0.1uF  [EDGE-LIBRARY_TUTORIAL---FUSION-360_CAPC1005X60]  35.3,146.7 270 top
C64  10uF  [EDGE-LIBRARY_TUTORIAL---FUSION-360_CAPC2012X110]  33.1,145.2 270 top
C65  0.1uF  [EDGE-LIBRARY_TUTORIAL---FUSION-360_CAPC1005X60]  27.8,157.3 90 top
C66  0.1uF  [EDGE-LIBRARY_TUTORIAL---FUSION-360_CAPC1005X60]  29.5,148.5 180 top
C67  0.1uF  [EDGE-LIBRARY_TUTORIAL---FUSION-360_CAPC1005X60]  37.4,157.6 90 top
C68  22uF  [EDGE-LIBRARY_TUTORIAL---FUSION-360_CAPC1005X60]  34.6,87.7 270 top
C69  22uF  [EDGE-LIBRARY_TUTORIAL---FUSION-360_CAPC1005X60]  32.3,87.7 270 top
C70  22uF  [EDGE-LIBRARY_TUTORIAL---FUSION-360_CAPC1005X60]  29.6,87.7 270 top
C71  DNP  [EDGE-LIBRARY_TUTORIAL---FUSION-360_CAPC1005X60]  38,84.1 270 top
C72  2700pF  [EDGE-LIBRARY_TUTORIAL---FUSION-360_CAPC1005X60]  29.6,84.1 90 top
C73  15pF  [EDGE-LIBRARY_TUTORIAL---FUSION-360_CAPC1005X60]  28.6,79.8 270 top
C74  0.1uF  [EDGE-LIBRARY_TUTORIAL---FUSION-360_CAPC1005X60]  26.3,71.1 270 top
C75  10000pF  [EDGE-LIBRARY_TUTORIAL---FUSION-360_CAPC1005X60]  32.4,65.2 270 top
C76  10uF  [EDGE-LIBRARY_TUTORIAL---FUSION-360_CAPC2012X110]  29.8,65.2 270 top
C77  1uF  [EDGE-LIBRARY_TUTORIAL---FUSION-360_CAPC1005X60]  30.5,157.2 90 top
C78  0.1uF  [EDGE-LIBRARY_TUTORIAL---FUSION-360_CAPC1005X60]  27.3,142.6 180 top
C79  1uF  [EDGE-LIBRARY_TUTORIAL---FUSION-360_CAPC1005X60]  34.5,157.3 90 top
C80  1uF  [EDGE-LIBRARY_TUTORIAL---FUSION-360_CAPC1005X60]  46,158 90 top
C81  22uF  [EDGE-LIBRARY_TUTORIAL---FUSION-360_CAPC1005X60]  27.3,144.6 180 top
C82  1uF  [EDGE-LIBRARY_TUTORIAL---FUSION-360_CAPC1005X60]  51,152.9 270 top
C83  DNP  [EDGE-LIBRARY_TUTORIAL---FUSION-360_CAPC1005X60]  44.4,177.5 270 top
C84  DNP  [EDGE-LIBRARY_TUTORIAL---FUSION-360_CAPC1005X60]  41.6,187.7 180 top
C85  DNP  [EDGE-LIBRARY_TUTORIAL---FUSION-360_CAPC1005X60]  53,177.8 90 top
C86  DNP  [EDGE-LIBRARY_TUTORIAL---FUSION-360_CAPC1005X60]  56.7,179.5 180 top
C87  22uF  [EDGE-LIBRARY_TUTORIAL---FUSION-360_CAPC1005X60]  56.3,74.2 270 top
C88  22uF  [EDGE-LIBRARY_TUTORIAL---FUSION-360_CAPC1005X60]  58.8,74.2 270 top
C89  22uF  [EDGE-LIBRARY_TUTORIAL---FUSION-360_CAPC1005X60]  53.8,74.2 270 top
C90  22uF  [EDGE-LIBRARY_TUTORIAL---FUSION-360_CAPC1005X60]  51.4,74.2 270 top
C91  DNP  [EDGE-LIBRARY_TUTORIAL---FUSION-360_CAPC1005X60]  63.6,70.4 270 top
C92  2700pF  [EDGE-LIBRARY_TUTORIAL---FUSION-360_CAPC1005X60]  56.3,70.4 90 top
C93  33pF  [EDGE-LIBRARY_TUTORIAL---FUSION-360_CAPC1005X60]  55,67.9 270 top
C94  0.1uF  [EDGE-LIBRARY_TUTORIAL---FUSION-360_CAPC1005X60]  53,60.4 270 top
C95  10000pF  [EDGE-LIBRARY_TUTORIAL---FUSION-360_CAPC1005X60]  58.8,52.7 270 top
C96  10uF  [EDGE-LIBRARY_TUTORIAL---FUSION-360_CAPC2012X110]  56,52.6 270 top
D1  30V 200MA  [EDGE-LIBRARY_SOT23]  101.29,29.75 90 top
D3  EDGE-LIBRARY_MMBZ5242BLT3G  [EDGE-LIBRARY_SOT23]  34.74,27.45 180 top
FB1  WLBD2012HCU121TH791-WLBD2012HCU121TH  [EDGE-LIBRARY_0805]  92.1,28.82 90 top
FB2  WLBD2012HCU121TH791-WLBD2012HCU121TH  [EDGE-LIBRARY_0805]  52.8,189.1 270 top
FB3  WLBD2012HCU121TH791-WLBD2012HCU121TH  [EDGE-LIBRARY_0805]  21.1,88.2 180 top
FB6  SAMACSYS_PARTS_BLM18PG121SN1D  [SAMACSYS_PARTS_BLM18AG102BH1D]  49.5,150.6 90 top
J2  2011-1X03G00SD025B  [CON-LSTB_MA03-1]  137.69,44.28 90 top
J3  L712RAS_L712RAS  [L712RAS_SWITCHCRAFT_L712RAS]  15.8,84.9 0 top
J4  2011-2X07G00SB  [CON-LSTB_MA07-2]  70.44,93.41 90 top
J5  EDGE-LIBRARY_L836-1J1T-43_L836-1J1T-43  [EDGE-LIBRARY_L836-1J1T-43_BEL_L836-1J1T-43]  10.96,121.47 90 top
J6  67996-140HLF  [HDRV40W67P254_2X20_5080X483X85]  162.82,79.75 180 top
J7  EDGE-LIBRARY_HDMI_CONNECTOR_RT_SMA  [EDGE-LIBRARY_STEWART_SS-53000-001]  94.39,211.5 180 top
J9  EDGE-LIBRARY_PCIE_CONNECTOR_36POS  [EDGE-LIBRARY_AMPHENOL_10018784-10210TLF]  89.1,121.5 0 top
J13  2553-2011-1X03G00SB-ND  [CON-LSTB_MA03-1]  117.9,28.8 0 top
J14  EDGE-LIBRARY_USB_A_2PORT_STACKED_SMA  [EDGE-LIBRARY_67298-4090_MOLEX_67298-4090]  10.03,198.26 270 top
J16  L712RAS_L712RAS  [L712RAS_SWITCHCRAFT_L712RAS]  15.68,23.22 0 top
J17  EDGE-LIBRARY_L836-1J1T-43_L836-1J1T-43  [EDGE-LIBRARY_L836-1J1T-43_BEL_L836-1J1T-43]  10.9,152.62 90 top
J18  ZX62-B-5PA_33_  [ZX62B5PA33]  61.9,203.9 180 top
J19  TSW-103-07-L-T  [HDRV9W64P254_3X3_762X749X838P]  99.4,12.6 0 top
JP1  PINHD-2X5  [2X05]  48.77,173.13 0 top
L1  EDGE-LIBRARY_SRN6045TA-3R3Y_SRN6045TA-3R3Y  [EDGE-LIBRARY_SRN6045TA-3R3Y_IND_SRN6045TA-3R3Y]  94,81.27 180 top
L2  EDGE-LIBRARY_SRN6045TA-3R3Y_SRN6045TA-3R3Y  [EDGE-LIBRARY_SRN6045TA-3R3Y_IND_SRN6045TA-3R3Y]  76.2,52.17 180 top
L3  EDGE-LIBRARY_SRN6045TA-3R3Y_SRN6045TA-3R3Y  [EDGE-LIBRARY_SRN6045TA-3R3Y_IND_SRN6045TA-3R3Y]  81.64,23.61 90 top
L4  EDGE-LIBRARY_SRN6045TA-3R3Y_SRN6045TA-3R3Y  [EDGE-LIBRARY_SRN6045TA-3R3Y_IND_SRN6045TA-3R3Y]  22,77.6 90 top
L5  EDGE-LIBRARY_SRN6045TA-3R3Y_SRN6045TA-3R3Y  [EDGE-LIBRARY_SRN6045TA-3R3Y_IND_SRN6045TA-3R3Y]  44.7,65.3 90 top
L7  3.3uH 1.5A 70m  [INDPM3030X150N]  30.3,144.6 90 top
LED1  LTST-S270KGKT  [LED_CHIP-LED0603]  20.81,97.37 270 top
LED2  LTST-S270KGKT  [LED_CHIP-LED0603]  20.91,100.95 270 top
LED3  LTST-S270KGKT  [LED_CHIP-LED0603]  21.01,94.72 270 top
LED4  LTST-S270KGKT  [LED_CHIP-LED0603]  20.8,104.8 270 top
LED5  TLPR5600  [TLPP5600]  17.1,101.6 270 top
LED6  TLPR5600  [TLPP5600]  17.3,95.9 270 top
LED7  TLPR5600  [TLPP5600]  17,107.2 270 top
MGT1  MOUNTING_HOLE  [BEAGLEBONEBLACK_MOUNTING_HOLE]  8,212 0 top
MGT2  MOUNTING_HOLE  [BEAGLEBONEBLACK_MOUNTING_HOLE]  8,8 0 top
MGT3  MOUNTING_HOLE  [BEAGLEBONEBLACK_MOUNTING_HOLE]  162,8 0 top
MGT4  MOUNTING_HOLE  [BEAGLEBONEBLACK_MOUNTING_HOLE]  162,212 0 top
MGT5  MOUNTING_HOLE  [BEAGLEBONEBLACK_MOUNTING_HOLE]  85,160 0 top
MGT6  MOUNTING_HOLE  [BEAGLEBONEBLACK_MOUNTING_HOLE]  85,70 0 top
MGT11  MOUNTING_HOLE  [BEAGLEBONEBLACK_MOUNTING_HOLE]  167.4,78.4 0 top
MGT12  MOUNTING_HOLE  [BEAGLEBONEBLACK_MOUNTING_HOLE]  167.4,127.4 0 top
MGT13  MOUNTING_HOLE  [BEAGLEBONEBLACK_MOUNTING_HOLE]  109.66,127.4 90 top
MGT14  MOUNTING_HOLE  [BEAGLEBONEBLACK_MOUNTING_HOLE]  109.66,78.4 0 top
MOD1  EDGE-LIBRARY_RPI-CM4  [EDGE-LIBRARY_RPI-CM4]  147.7,189.9 180 top
Q2  RQ3E120ATTB  [RQ3E100ATTB]  27.7,27.6 90 top
R1  309k  [EDGE-LIBRARY_TUTORIAL---FUSION-360_RESC1005X40]  35.3,84.1 90 top
R2  15.8k  [EDGE-LIBRARY_TUTORIAL---FUSION-360_RESC1005X40]  31.1,79.8 270 top
R3  22.1k  [EDGE-LIBRARY_TUTORIAL---FUSION-360_RESC1005X40]  32.4,84.1 270 top
R4  470  [EDGE-LIBRARY_TUTORIAL---FUSION-360_RESC1005X40]  25.93,94.58 180 top
R5  470  [EDGE-LIBRARY_TUTORIAL---FUSION-360_RESC1005X40]  20.56,109.9 0 top
R6  470  [EDGE-LIBRARY_TUTORIAL---FUSION-360_RESC1005X40]  22.28,136.1 0 top
R7  470  [EDGE-LIBRARY_TUTORIAL---FUSION-360_RESC1005X40]  14.3,134.2 0 top
R8  12k  [EDGE-LIBRARY_TUTORIAL---FUSION-360_RESC1005X40]  126.12,204.4 0 top
R9  10k  [EDGE-LIBRARY_TUTORIAL---FUSION-360_RESC1005X40]  119.8,15.91 90 top
R10  10.5k  [EDGE-LIBRARY_TUTORIAL---FUSION-360_RESC1005X40]  100.03,80.42 270 top
R11  15.8k  [EDGE-LIBRARY_TUTORIAL---FUSION-360_RESC1005X40]  83.13,53.87 270 top
R12  69.8k  [EDGE-LIBRARY_TUTORIAL---FUSION-360_RESC1005X40]  102.97,76.18 90 top
R13  22k  [EDGE-LIBRARY_TUTORIAL---FUSION-360_RESC1005X40]  102.95,73.84 90 top
R14  115k  [EDGE-LIBRARY_TUTORIAL---FUSION-360_RESC1005X40]  86.25,50.39 90 top
R15  22.1k  [EDGE-LIBRARY_TUTORIAL---FUSION-360_RESC1005X40]  86.45,47.24 90 top
R16  15k  [EDGE-LIBRARY_TUTORIAL---FUSION-360_RESC1005X40]  61.84,88.25 180 top
R17  470  [EDGE-LIBRARY_TUTORIAL---FUSION-360_RESC1005X40]  43.32,99.19 180 top
R18  470  [EDGE-LIBRARY_TUTORIAL---FUSION-360_RESC1005X40]  37.8,101.15 180 top
R19  510k  [EDGE-LIBRARY_TUTORIAL---FUSION-360_RESC1005X40]  123.85,35.86 90 top
R20  510k  [EDGE-LIBRARY_TUTORIAL---FUSION-360_RESC1005X40]  121.58,39.15 0 top
R21  36k  [EDGE-LIBRARY_TUTORIAL---FUSION-360_RESC1005X40]  55.15,185.17 180 top
R22  36k  [EDGE-LIBRARY_TUTORIAL---FUSION-360_RESC1005X40]  55.16,183.35 180 top
R23  36k  [EDGE-LIBRARY_TUTORIAL---FUSION-360_RESC1005X40]  55.14,181.55 180 top
R24  2.2k  [EDGE-LIBRARY_TUTORIAL---FUSION-360_RESC1005X40]  63.25,196.5 90 top
R25  2.2k  [EDGE-LIBRARY_TUTORIAL---FUSION-360_RESC1005X40]  46.52,199.55 0 top
R26  12k  [EDGE-LIBRARY_TUTORIAL---FUSION-360_RESC1005X40]  39.85,192.12 270 top
R27  36k  [EDGE-LIBRARY_TUTORIAL---FUSION-360_RESC1005X40]  49.95,197.7 270 top
R28  115k  [EDGE-LIBRARY_TUTORIAL---FUSION-360_RESC1005X40]  61.2,70.4 90 top
R29  12k  [EDGE-LIBRARY_TUTORIAL---FUSION-360_RESC1005X40]  30.96,28.55 180 top
R30  37.4k  [EDGE-LIBRARY_TUTORIAL---FUSION-360_RESC1005X40]  80.21,16.25 180 top
R31  309k  [EDGE-LIBRARY_TUTORIAL---FUSION-360_RESC1005X40]  77.9,14.85 0 top
R32  22.1k  [EDGE-LIBRARY_TUTORIAL---FUSION-360_RESC1005X40]  74.44,12.45 0 top
R33  10k  [EDGE-LIBRARY_TUTORIAL---FUSION-360_RESC1005X40]  34.6,140 270 top
R34  [EDGE-LIBRARY_0805]  129.1,146.6 0 top
R35  [EDGE-LIBRARY_0805]  129.5,144.4 0 top
R36  15.8k  [EDGE-LIBRARY_TUTORIAL---FUSION-360_RESC1005X40]  57.5,67.9 270 top
R38  22.1k  [EDGE-LIBRARY_TUTORIAL---FUSION-360_RESC1005X40]  58.8,70.4 270 top
R40  10k  [EDGE-LIBRARY_TUTORIAL---FUSION-360_RESC1005X40]  42.7,147.3 180 top
R41  470  [EDGE-LIBRARY_TUTORIAL---FUSION-360_RESC1005X40]  19.3,169.1 180 top
R48  470  [EDGE-LIBRARY_TUTORIAL---FUSION-360_RESC1005X40]  23.5,104.8 180 top
R49  470  [EDGE-LIBRARY_TUTORIAL---FUSION-360_RESC1005X40]  29.8,137.8 180 top
R50  470  [EDGE-LIBRARY_TUTORIAL---FUSION-360_RESC1005X40]  19.3,172.1 180 top
R51  10k  [EDGE-LIBRARY_TUTORIAL---FUSION-360_RESC1005X40]  46,155.4 270 top
R52  12k  [EDGE-LIBRARY_TUTORIAL---FUSION-360_RESC1005X40]  42,157 0 top
R53  10k  [EDGE-LIBRARY_TUTORIAL---FUSION-360_RESC1005X40]  44,153.4 180 top
R54  2k  [EDGE-LIBRARY_TUTORIAL---FUSION-360_RESC1005X40]  32.6,157.2 90 top
R55  10k  [EDGE-LIBRARY_TUTORIAL---FUSION-360_RESC1005X40]  45.2,145.2 180 top
U1  EDGE-LIBRARY_TPD4EUSB30DQAR_TPD4EUSB30DQAR  [EDGE-LIBRARY_TPD4EUSB30DQAR_IC_TPD4EUSB30DQAR]  28.46,123.7 180 top
U2  EDGE-LIBRARY_TPD4EUSB30DQAR_TPD4EUSB30DQAR  [EDGE-LIBRARY_TPD4EUSB30DQAR_IC_TPD4EUSB30DQAR]  28.46,118.85 180 top
U3  EDGE-LIBRARY_AP64501_AP64501  [EDGE-LIBRARY_AP64501_SOIC127P600X265-9T261X350N]  30.5,71 90 top
U4  EDGE-LIBRARY_74LVC1G07SE-7  [EDGE-LIBRARY_SOT65P210X110-5N]  129.45,40.56 90 top
U5  MIC2025-2YMM  [SOP65P490X110-8N]  120.8,205.4 180 top
U6  SAMACSYS_PARTS_TPS3850G33DRCT  [SAMACSYS_PARTS_SON50P300X300X100-11N]  114.93,15.31 0 top
U7  EDGE-LIBRARY_AP64501_AP64501  [EDGE-LIBRARY_AP64501_SOIC127P600X265-9T261X350N]  99.34,71.89 90 top
U8  EDGE-LIBRARY_AP64501_AP64501  [EDGE-LIBRARY_AP64501_SOIC127P600X265-9T261X350N]  82.64,45.34 90 top
U9  EDGE-LIBRARY_AP2553AW6-7  [EDGE-LIBRARY_SOT95P280X140-6N]  57.25,85.56 90 top
U10  MCP7940N-E_MS  [SOP65P490X110-8N]  106.5,34.6 180 top
U11  EDGE-LIBRARY_74LVC1G07SE-7  [EDGE-LIBRARY_SOT65P210X110-5N]  117.66,39.15 180 top
U12  EDGE-LIBRARY_TPD4EUSB30DQAR_TPD4EUSB30DQAR  [EDGE-LIBRARY_TPD4EUSB30DQAR_IC_TPD4EUSB30DQAR]  26.16,199.05 0 top
U13  EDGE-LIBRARY_USB2514B-I_M2_USB2514B-I/M2  [EDGE-LIBRARY_USB2514B-I_M2_QFN50P600X600X100-37N]  46.4,182.4 0 top
U14  FSUSB42UMX  [QFN40P140X180X55-10N]  39.74,200.27 180 top
U15  EDGE-LIBRARY_AP64501_AP64501  [EDGE-LIBRARY_AP64501_SOIC127P600X265-9T261X350N]  72.29,17.06 0 top
U16  LAN7800-I_VSX  [QFN40P600X600X90-49N]  37.5,152 0 top
U17  SAMACSYS_PARTS_93AA66AT-I_OT  [SAMACSYS_PARTS_SOT95P270X145-6N]  39.14,140.41 0 top
U18  EDGE-LIBRARY_TPD4EUSB30DQAR_TPD4EUSB30DQAR  [EDGE-LIBRARY_TPD4EUSB30DQAR_IC_TPD4EUSB30DQAR]  26.56,154.95 180 top
U19  EDGE-LIBRARY_TPD4EUSB30DQAR_TPD4EUSB30DQAR  [EDGE-LIBRARY_TPD4EUSB30DQAR_IC_TPD4EUSB30DQAR]  26.56,150.55 180 top
U20  EDGE-LIBRARY_AP64501_AP64501  [EDGE-LIBRARY_AP64501_SOIC127P600X265-9T261X350N]  56.9,60.6 90 top
U21  EDGE-LIBRARY_TPD4EUSB30DQAR_TPD4EUSB30DQAR  [EDGE-LIBRARY_TPD4EUSB30DQAR_IC_TPD4EUSB30DQAR]  26.06,193.9 0 top
U$1  [PASS-ROUND]  166,215.4 0 top
U$3  [PASS-ROUND]  166.2,5.2 0 top
U$4  [PASS-ROUND]  3.9,4.4 0 top
U$8  [PASS-ROUND]  4.3,215.6 0 top
X1  1751248  [1751248]  44.6,78.9 90 top
Y1  XTAL32.7682-SMD  [XTAL_ECS-.327-12.5-34R-TR]  112.9,34.3 270 top
Y2  EDGE-LIBRARY_ABM8-24.000MHZ-B2-T_ABM8-24.000MHZ-B2-T  [EDGE-LIBRARY_ABM8-24.000MHZ-B2-T_OSCSC320X250X100N]  46.09,191.65 180 top
Y3  SAMACSYS_PARTS_ABM8G-25.000MHZ-B4Y-T3  [SAMACSYS_PARTS_ABM8G48000MHZ18D2YT]  38.16,161.77 270 top

## Tracks (layer width: path | path; a pad name or v marks a point on that pad's centre or on a via)
3V3  (via drill 0.35, 0.4, 0.5, 0.5 pad 1.3)
  Top 0.152: 34.23,147.2 34.4,147.2 | 35.7,147.68 35.7,147.59
  Top 0.2: U17.6 40.53,141.5 v41.7,141.5 | U16.20 38.1,148.6 38.4,148.3 v38.4,147.7 | R40.1 43.4,147.11 43.4,146.3 | 43.4,146.3 v43.4,146.2 | R55.1 45.7,146.2 45.6,146.3 43.4,146.3 | v41.7,155.4 42.21,155.91 R51.1 | U16.46 36.1,155.8 35.9,156 v35.9,156.06 | C38.1 46.05,156.65 v46,156.7 | C36.1 C38.1 | C37.1 48.85,156.6 C38.1 | C31.1 29.59,161.1 29.7,161.1 | 29.7,161.1 v30.4,161.1 | C34.1 v50.5,145.8 | C35.1 49.3,145.82 C34.1 | C33.1 49.33,145.79 C34.1 | U16.14 35.7,147.68 | C32.1 29.66,161.06 29.7,161.1 | U14.9 39.8,199.36 v39.8,198.1 | U10.8 104.28,30.73 v104.3,30.7 | 35.7,147.59 C63.1
  Top 0.254: LED2.A 18.32,100.95 LED5.2 | LED1.A 19,98.43 v19,98.7
  Top 0.305: U6.10 117.81,16.31 v117.9,16.4 117.92,16.42 R9.2 | v50.7,185.6 50.41,185.6 U13.27 | U16.39 U16.38 39.1,155.15 | v41.7,155.4 41.75,155.35 41.75,155.2 40.75,154.2 U16.36 | C80.1 v46,156.7 R51.1 | MOD1.78 v128.1,156.4
  Top 0.406: U13.23 v54,182.4 | v39.1,156.36 39.1,155.15 | J6.1 162.7,79.87 | U13.15 46.9,178.9 47.4,178.4 v51.3,178.4 52.88,178.4 C85.2 | FB2.1 52.8,191 v53.2,191.4 | C86.2 55,179.5 v53.7,180.8
  Top 0.508: 95.2,87.7 100.9,87.7 102.9,85.7 102.9,76.76 R12.2 104.88,76.69 C15.1 | 95.2,87.7 93.5,87.7 91.92,86.12 L1.2 | 95.2,87.7 94.39,88.5 C19.1 94.36,95.09 C17.1 94.36,101.83 C21.1
  Top 0.61: D1.2 v104.3,30.7 | 162.7,79.87 v162.7,82.1 | J6.17 v142.5,82.2 | J9.B8 J9.B10 | J17.14 2.01,153.91 4.55,156.45 J17.16 | J5.16 4.7,128.9 4.7,125.7 2.07,123.07 J5.14 7.46,108.56 15,108.56 | LED4.A 19.6,104.8 15.84,108.56 15,108.56 | LED7.2 15.09,108.47 15,108.56 | C64.1 34.23,147.2
  Bottom 0.406: v51.3,178.4 v53.7,180.8 54,181.1 v54,182.4
  Bottom 0.61: J17.14 2.01,136.59 4.61,133.99 J5.16
  other vias: 91.1,91.7 92,91.7 92.9,91.7 94,91.7 91.1,92.7 91.1,93.6 91.1,94.5 91.1,95.4 92,92.7 92,93.6 92,94.5 92,95.4 93,92.7 93,93.6 93,94.5 93,95.4 94,92.7 94,93.6 91.3,101.1 92.2,101.1 91.3,96.5 92.2,96.4 93.1,96.4 94,96.4 91.3,97.5 91.3,98.4 91.3,99.3 91.3,100.2 93.2,101.1 94.2,99.3 94.2,100.2 93.2,97.5 93.2,98.4 93.2,99.3 93.2,100.2 92.2,97.5 92.2,98.4 92.2,99.3 92.2,100.2 91.1,90.7 91.1,89.8 91.1,88.9 91.9,88.9 92,89.8 92,90.7 92.9,90.7 92.9,89.8 92.9,88.9 93.8,88.9 93.8,89.8 93.8,90.7 34.6,148.1
  pour Top (no thermals): 90.9,83.4 90.9,101.5 91.5,102.1 93.9,102.1 94.4,101.6 94.4,92.1 97.1,89.4 102.6,89.4 103,89 103,76.6 102.9,76.7 101.6,76.7 101.4,76.9 101.4,85.2 100.7,85.9 93.1,85.9 92.9,85.7 92.9,83.2 92.7,83.4
  pour Top: 93.7,99.7 93.8,99.6 93.8,95.4 93.5,95.1
  pour 3v3: 14.5,9 14.4,14.2 14.4,191.7 11.8,194.3 11.8,204.7 14.5,207.4 163.6,207.4 164.19,18.89 154.3,9
  pour Top: 35.6,147.5 35.6,147.3 35.4,147.1 33.8,147.1 33.8,147.8 34.2,148.2 35.7,148.2
3V3CM4
  Top 0.2: MOD1.84 MOD1.86
5V  (via drill 0.35, 0.6, 1)
  Top 0.127: C10.1 57.09,81.11 66.2,72 74.17,72 74.38,72.2
  Top 0.15: MOD1.83 129.3,150.7 129.23,150.63
  Top 0.2: 129.01,36.35 C20.1 | R20.2 122.14,39.2 | MOD1.77 129.4,150.06 129.7,150.06 | 129.7,150.06 129.8,150.06 | MOD1.87 130.1,150.36 129.8,150.06 | MOD1.85 129.7,150.96 | 129.7,150.16 129.8,150.06 | MOD1.83 129.7,150.96 | 129.7,150.96 129.7,150.16 | 129.7,150.16 129.7,150.1 | 129.7,150.1 129.7,150.06 | MOD1.81 128.9,150.9 129.7,150.1 | MOD1.79 129.23,150.63 129.7,150.16
  Top 0.305: U9.1 56.3,81.16 C10.1
  Top 0.406: C29.1 115.17,40.03 U11.5 v115.3,38.5 | 122.14,39.2 v123.9,39.2 | U6.1 111.29,16.31 v109.1,18.5 | 129.01,36.35 129,36.37 R19.2 123.9,36.42 v123.9,39.2 | U4.5 124.82,41.52 123.9,40.6 v123.9,39.2
  Top 0.508: L2.2 74.12,64.7 C18.1 74.47,68.63 C22.1 74.45,71.77 C24.1 | U5.7 120.33,205.07
  Top 0.61: C24.1 74.38,72.2 | 129.8,150.06 v129.8,148.3 | R8.2 129.3,204.4 | 129.3,204.4 129.6,204.4 v130.7,203.3 | 129.3,204.4 126.7,201.8 123.6,201.8 120.33,205.07
  Top 2.54: v141.6,53.7 152.7,53.7 162.82,63.82 J6.2 J6.4
  3v3 0.61: v130.7,203.3 138.6,203.3 163,178.9 163,154.8 156.5,148.3 v129.8,148.3
  3v3 2.54: J6.4 160.28,73.78 157.5,71 106.5,71 105.7,71.8 105.7,82.6 109.4,86.3 109.4,116.8 104.9,121.3 104.9,135.9 117.3,148.3 v129.8,148.3
  Bottom 0.406: 106.4,38.5 v115.3,38.5 123.2,38.5 v123.9,39.2
  Bottom 0.61: v109.1,18.5 106.4,21.2 106.4,38.5 106.4,48.1 104.3,50.2
  Bottom 2.54: 104.3,50.2 100.95,53.55 | 100.95,53.55 92.5,62 v87.6,62 | v141.6,53.7 101.1,53.7 100.95,53.55
  pour Top (no thermals): 75.2,54.6 75.2,58.5 84.5,58.5 84.7,58.3 84.7,50.9 88.2,50.9 88.2,63 76.2,63 74.4,64.8 74.4,72 74.5,72.1 72.7,72.1 72.3,71.7 72.3,56.1 73.5,54.9 73.5,54.5 75.1,54.5
  pour Top (no thermals): 56.2,80.9 57.3,80.9 66.9,71.3 74.5,71.3 74.5,72.4 67.1,72.4 57.5,82 56.3,82 56.3,81
  pour Top (no thermals): 128,151.4 130.2,151.4 130.2,149.7 129,149.7 128,150.7
5V-PELTIER
  Top 0.2: 63.58,70.91 C91.1
  Top 0.61: 63.58,70.91 R28.2 61.2,74.1 60.62,74.69 C88.1 C87.1 C89.1 C90.1 44.72,74.69 44.7,74.7
  Top 2.54: L5.2 44.7,74.7 X1.1
12V3A_OPTIC_OUT
  Top 0.254: J3.C
  pour Top (no thermals): 14.2,87.1 20.4,87.1 20.4,89.3 20.3,89.4 14.2,89.4
12V_OPTIC_OUT
  Top 0.254: LED6.2 15.27,97.17 14.7,96.6 14.7,93.7 15,93.4 16.5,93.4 16.9,93 16.9,92.9 17.3,92.5 19.4,92.5 | LED3.A 20.26,93.24 22,91.5 FB3.1
  Top 0.406: LED3.A 19.4,93.86 19.4,92.5
  Top 0.61: R1.2 37.98,84.61 | 37.98,84.61 C71.1 | FB3.1 29.59,88.2 C70.1 C69.1 C68.1 C1.1 36.78,88.1 38,88.1 38,84.63 37.98,84.61
  pour Top (no thermals): 21.6,89.4 21.6,79.6 24.3,79.6 24.3,89.4
12V_REGULATED
  Top 0.61: 69.53,26.5 69.52,26.48
  pour Top (no thermals): 78.3,14.8 85.8,14.8 85.9,14.9 85.9,23.7 84.8,24.8 78.5,24.8 78.2,25.1 78.2,25.5 78.1,25.4 69,25.4 69,28.3 95.3,28.3 95.7,27.9 95.7,25.7 91.6,25.7 91.4,25.9 91.3,25.9 90.5,25.1 90.5,12.7 90.1,12.3 78.4,12.3 78.4,14.7
24V_UNREG
  Top 0.2: Q2.1 34.47,26.62 D3.3 39.65,21.44 C45.1 39.67,19.66 C47.1 | Q2.3 Q2.2 | U15.3 U15.2 | 29.86,66.5 29.86,65.42 C76.1
  Top 0.254: 34.79,26.3 D3.3
  Top 0.61: 38.1,26.3 34.79,26.3 | 26.4,65.7 29.79,65.7 C76.1
  Top 1.27: 29.86,66.5 U3.2
  Top 2.54: 38.1,26.3 38.1,35.5 26.4,47.2 26.4,65.7
  pour Top (no thermals): 29.1,27.9 29.1,20.6 30.2,19.5 42.5,19.5 45.6,16.4 70.4,16.4 70.4,17.8 70.5,17.9 47.8,17.9 38.9,26.8 30.96,26.8 29.86,27.9
  pour Top (no thermals): 30.2,65.6 28.6,65.6 27,64 25.4,64 25.4,66.1 26.4,67.1 30.2,67.1
!BOOTLED  (via drill 0.35)
  Top 0.2: v25.8,104.8 24.41,104.8
  Top 0.406: R48.1 24.41,104.8
  Bottom 0.2: J13.1 115.36,26.6 116.3,25.66 116.3,10.9 115,9.6 23,9.6 18.3,14.3 18.3,95.5 25.8,103 v25.8,104.8
!EXTRST  (via drill 0.5)
  Top 0.2: U13.26 50.3,183.9 53.5,187.1 57.8,187.1 72.5,172.4 v72.5,145.8 | MOD1.100 133,153.94 133,149.3 134.4,147.9 v134.4,131.8
  Bottom 0.2: v134.4,131.8 133.4,130.8 106.4,130.8 104.8,129.2 104.8,118 99.5,112.7 74.9,112.7 72.5,115.1 v72.5,145.8
!OCS1  (via drill 0.5)
  Top 0.15: U13.13 45.9,180.2 46.04,180.34 47.61,180.34 | U13.17 47.9,180.04 47.61,180.34 | 47.61,180.34 49.15,180.34 U13.19 50,180.4 50.2,180.6 50.2,181.2 50,181.4 U13.21
  Top 0.2: U13.19 53.1,180.4 v58.4,175.1 | U9.4 58.84,86.1 v61.6,86.1
  Bottom 0.2: v58.4,175.1 58.4,100.5 63.2,95.7 63.2,87.7 v61.6,86.1
!PI_LED_PWR  (via drill 0.5)
  Top 0.2: MOD1.95 131.7,126.58 v131.78,126.5 | R17.1 43.85,99.17 54.97,99.17 56.89,101.09 60.21,101.09 v62.6,98.7 | v107.55,88.2 109.55,90.2 109.55,122.45 110.5,123.4 v111.7,123.4
  Bottom 0.2: v131.78,126.5 128.68,123.4 v111.7,123.4 | v62.6,98.7 64.7,96.6 64.7,90.6 68.2,87.1 73.6,87.1 76.1,84.6 106.4,84.6 107.55,85.75 v107.55,88.2
!RPIBOOT  (via drill 0.5)
  Top 0.2: v129.8,123.2 129.8,141.3 131.3,142.8 MOD1.93 | v112.2,86.4 112.3,86.5 v112.3,121 | v130.3,72.85 v141.2,72.85
  Bottom 0.2: v129.8,123.2 127.6,121 v112.3,121 | J4.2 69.17,83.83 69.9,83.1 109,83.1 112.2,86.3 v112.2,86.4 112.2,73.7 113.05,72.85 v130.3,72.85 | v141.2,72.85 146,68.05 146,43.3 131.5,28.8 J13.3
!RTC_INT
  Top 0.2: 123.82,35.38 C30.1 119.31,35.38 116.9,37.8 106,37.8 105.6,37.4 105.6,34.4 105.4,34.2 104.35,34.2 U10.7
  Top 0.406: 123.82,35.38 R19.1
+12V  (via drill 0.5)
  Top 0.152: C5.1 84.1,37.87 84.1,39.4 83.28,40.23 83.28,40.5 | 83.28,40.5 U8.3 | 82,40.5 83.28,40.5 | U20.2 56.27,53.74
  Top 0.2: 91.4,29.6 91.42,29.62
  Top 0.254: U8.2 82,41.1 82,40.5 | C5.1 83.76,37.24 84.75,36.25
  Top 0.61: U7.2 U7.3
  Top 0.813: C96.1 56.27,53.74 56.27,58
  Top 2.54: 53.7,54.4 53.7,37.2 57.2,33.7 82.2,33.7 84.75,36.25
  3v3 0.61: v99.6,63.5 94,69.1 94.1,69.2 82.8,80.5 82.8,111.4 78.45,115.75 J9.B2 78.45,119.25 | J9.B3 J9.A3 79.45,123.75 J9.A2 | J9.B3 J9.B1 78.45,119.25 | J9.B3 78.45,119.25
  pour Top (no thermals): 81.9,42.4 81.9,40.4 84,38.3 84,36.9 90.8,30.1 91.7,32.9 84.2,39.8 83.3,40.7 83.3,42.4
  pour Top (no thermals): 90.2,56.1 90.2,32.1 92.8,29.5 95,29.5 95,55.8 100.3,61.1 100.3,70 98.4,70
  pour Top (no thermals): 91.7,32.9 93.2,31.4 93.2,29.5 91.3,29.5 90.4,30.4 90.4,30.5 89.9,31 89.9,31.2 91.6,32.9
  pour Top (no thermals): 56.6,53.1 56.6,58.5 56,58.5 56,56.9 55.6,56.5 52.8,56.5 52.8,53.7 53.4,53.1
ACTIVE_!LED
  Top 0.2: MOD1.21 116.9,149.2 112,144.3 112,137.6 104.2,129.8 104.2,105.7 103.8,105.3 44.7,105.3 40.55,101.15 R18.1
ANALOG_IN0  (via drill 0.5)
  Top 0.2: MOD1.96 131.7,154.9 132.1,155.3 133,155.3 133.4,154.9 133.4,150 135.3,148.1 v135.3,130 | v107.55,129.3 105.05,126.8 v105.05,100.25
  Bottom 0.2: v107.55,129.3 108.25,130 v135.3,130 | J4.5 76.38,86.2 104.26,86.2 105.05,86.99 v105.05,100.25
ANALOG_IN1  (via drill 0.5)
  Top 0.2: MOD1.94 131.3,155.2 131.8,155.7 133.5,155.7 134,155.2 134,150.36 137.23,147.13 137.23,128.46 v136.97,128.2 | v112,124.9 106.2,124.9 v106.2,96.6 | v78.98,85.4 76.39,82.8 66.6,82.8 64.9,84.5 64.9,89.4 66.37,90.87 J4.6
  Bottom 0.2: v136.97,128.2 136.87,128.3 128.1,128.3 124.7,124.9 v112,124.9 | v106.2,96.6 106.2,86.9 104.7,85.4 v78.98,85.4
BT_!DISABLE
  Top 0.2: R35.2 130.9,145.18 MOD1.91
CGND  (via drill 1 pad 1.3)
  Top 0.61: J17.S2 10.9,165.4 13.5,168 v15.8,168 | J17.S1 10.9,141.6 12.9,139.6 v17,139.6
  3v3 0.61: J5.S2 7.95,133.26 7.95,158.67 9.2,159.91 9.2,183.83 6.6,186.43 6.6,210.6 MGT1.P$1
  pour 3v3 (no thermals): 169.1,2.2 1.8,2.2 1.8,12.7 11.5,12.7 11.5,5.7 160.1,5.7 160.1,10.1 169.1,10.1
  pour 3v3 (no thermals): 6.8,12.7 6.8,106.1 12.3,106.1 12.3,188.8 8,188.8 8,208.3 11.6,208.3 11.6,211 158.9,211.2 160.9,209.2 166.9,209.2 166.9,9.9 169.1,9.9 169.1,218.5 1.3,218.5 1.2,163.8 7.5,163.8 8.4,162.9 8.4,158.48 6.72,158.48 6.8,158.4 6.79,142.91 6.79,133.79 6.38,133.38 6.49,111.1 1.7,111.1 1.7,12.7
EECLK
  Top 0.2: U16.19 37.7,147.3 39.1,145.9 42,145.9 42.6,145.3 42.6,139.62 | R49.1 41.5,137.8 42.6,138.9 42.6,139.62 | 42.6,139.62 42.44,139.46 U17.4
EECS  (via drill 0.35)
  Top 0.2: U17.5 41.69,140.41 41.7,140.4 v41.8,140.4 | U16.16 36.5,143.2 v35.2,141.9 35.2,141.11 R33.1
  Bottom 0.2: v41.8,140.4 40.3,141.9 v35.2,141.9
EEDI
  Top 0.2: U16.17 36.9,142.6 35.7,141.4 35.7,139.8 36.04,139.46 U17.3
EEDO
  Top 0.2: U17.1 37.3,141.95 U16.18
EEPROM_!WP  (via drill 0.5)
  Top 0.2: MOD1.20 116.5,160.3 115.8,161 92.8,161 79.5,147.7 79.5,142.8 v62.8,126.1
  Bottom 0.2: J4.4 68.67,88.33 65.53,91.47 65.53,114.14 62.8,116.86 v62.8,126.1
ENET1_D0_N
  Top 0.127: U16.2 31.84,153.8 30.04,155.6 27.53,155.6 27.38,155.45 U18.4 26.69,155.45 26.6,155.54 23.5,155.54 arc-90 23.02,156.02 arc90 22.84,156.2 22.3,156.2 arc90 22.13,156.02 arc-90 21.64,155.54 20.93,155.54 J17.10
ENET1_D0_P
  Top 0.127: U16.1 31.8,154.2 30.14,155.86 27.5,155.86 27.41,155.95 U18.5 26.75,155.95 26.6,155.8 23.5,155.8 arc-90 23.27,156.02 arc90 22.79,156.51 22.35,156.51 arc90 21.87,156.02 arc-90 21.64,155.8 20.93,155.8 J17.11
ENET1_D1_N  (via drill 0.5)
  Top 0.127: U16.5 30.84,152.6 29.34,154.1 27.13,154.1 U18.1 26.44,153.95 26.32,154.07 24.71,154.07 v24.3,153.66
  Bottom 0.127: v24.3,153.66 24.23,153.59 19.58,153.59 J17.5
ENET1_D1_P  (via drill 0.5)
  Top 0.127: U16.4 30.8,153 29.44,154.36 27.4,154.36 27.31,154.45 U18.2 26.44,154.45 26.32,154.33 23.96,154.33 22.74,153.1 21.4,153.1 v21.1,152.8
  Bottom 0.127: v21.1,152.8 20.4,152.8 20.32,152.88 18.99,152.88 18.83,152.72 18.38,152.72 17.5,153.6 J17.4
ENET1_D2_N
  Top 0.127: U16.8 33.87,151.4 33.8,151.47 30.6,151.47 30.55,151.42 29.04,151.42 27.88,151.42 | 27.88,151.42 27.51,151.05 U19.4 25.79,151.05 25.7,151.14 21.56,151.14 21.1,151.6 19.7,151.6 17.67,149.57 J17.2 | 27.88,151.42
ENET1_D2_P
  Top 0.127: U16.7 33.87,151.8 33.8,151.73 30.35,151.73 30.3,151.68 27.78,151.68 27.65,151.55 U19.5 25.85,151.55 25.7,151.4 21.66,151.4 21.21,151.86 19.59,151.86 18.42,150.69 arc-90 18.15,150.95 J17.3
ENET1_D3_N  (via drill 0.5)
  Top 0.127: U16.11 33.5,150.2 32.94,149.64 27.07,149.64 U19.1 26.44,149.55 26.32,149.67 24.62,149.67 24.39,149.44 v24.39,148.81
  Bottom 0.127: J17.9 20.06,150.6 22.6,150.6 v24.39,148.81
ENET1_D3_P  (via drill 0.5)
  Top 0.127: U16.10 33.54,150.6 32.84,149.9 27.13,149.9 U19.2 26.44,150.05 26.32,149.93 22.93,149.93 22.75,149.76 v22.75,148.54
  Bottom 0.127: J17.8 22.74,148.56 v22.75,148.54
ENET_!LED1  (via drill 0.5)
  Top 0.2: MOD1.19 116.5,149.7 110.8,144 110.8,140.9 103.3,133.4 103.3,112.6 96.9,106.2 19.8,106.2 v19.7,106.1 | R7.2 15.4,134.2 v16.1,133.5
  Bottom 0.2: v19.7,106.1 19.7,108 16.1,111.6 v16.1,133.5
ENET_!LED2  (via drill 0.5)
  Top 0.2: MOD1.17 116.1,150.2 110,144.1 110,142.3 105.91,138.21 v104.29,138.21 | R6.2 67.2,136.1 75.7,144.6 75.7,162.8 78.2,165.3 v99,165.3
  Bottom 0.2: v99,165.3 102.8,161.5 102.8,139.7 v104.29,138.21
ENET_!LED3
  Top 0.2: MOD1.15 115.7,150.7 100.9,135.9 100.9,113.1 99,111.2 46.94,111.2 45.63,109.9 R5.2
ENET_D0_N
  Top 0.127: J5.10 20.8,124.2 U1.4 29,124.32 30.6,124.32 30.72,124.44 32.34,124.44 arc90 32.82,124.93 32.82,125.08 arc-90 33.05,125.3 36.09,125.3 arc-90 36.31,125.08 36.31,124.07 arc90 36.8,123.58 39.84,123.58 arc90 40.32,124.07 40.32,125.08 arc-90 40.55,125.3 43.59,125.3 arc-90 43.82,125.08 43.82,124.07 arc90 44.3,123.58 47.34,123.58 arc90 47.82,124.07 47.82,125.08 arc-90 48.05,125.3 51.09,125.3 arc-90 51.32,125.08 51.32,124.07 arc90 51.8,123.58 54.84,123.58 arc90 55.32,124.07 55.32,125.08 arc-90 55.55,125.3 58.59,125.3 arc-90 58.82,125.08 58.82,124.93 arc90 59.3,124.44 66.44,124.44 81.74,139.74 87.44,139.74 104.1,156.4 114.2,156.4 114.5,156.1 MOD1.10
ENET_D0_P
  Top 0.127: J5.11 20.94,124.7 U1.5 29,124.58 30.44,124.58 30.56,124.7 32.34,124.7 arc90 32.56,124.93 32.56,125.08 arc-90 33.05,125.56 36.09,125.56 arc-90 36.57,125.08 36.57,124.31 arc90 36.8,124.08 39.84,124.08 arc90 40.07,124.31 40.07,125.08 arc-90 40.55,125.56 43.59,125.56 arc-90 44.07,125.08 44.07,124.07 arc90 44.3,123.84 47.34,123.84 arc90 47.57,124.07 47.57,125.08 arc-90 48.05,125.56 51.09,125.56 arc-90 51.57,125.08 51.57,124.07 arc90 51.8,123.84 54.84,123.84 arc90 55.07,124.07 55.07,125.08 arc-90 55.55,125.56 58.59,125.56 arc-90 59.07,125.08 59.07,124.93 arc90 59.3,124.7 66.34,124.7 81.64,140 87.34,140 103.99,156.66 114.31,156.66 114.38,156.58 | 114.38,156.58 114.9,156.06 MOD1.12 | 114.38,156.58
ENET_D1_N
  Top 0.127: J5.5 17.56,124.34 19.5,122.4 25.6,122.4 26.4,123.2 U1.2 29.41,123.2 29.54,123.08 30.59,123.08 30.72,122.94 34.39,122.94 arc-90 34.88,122.46 34.88,121.9 arc90 35.1,121.67 35.33,121.67 arc90 35.56,121.9 35.56,122.46 arc-90 36.04,122.94 36.27,122.94 arc-90 36.76,122.46 36.76,121.64 arc90 36.98,121.42 37.21,121.42 arc90 37.44,121.64 37.44,122.46 arc-90 37.92,122.94 38.15,122.94 arc-90 38.63,122.46 38.63,121.64 arc90 38.86,121.42 39.09,121.42 arc90 39.32,121.64 39.32,122.46 arc-90 39.8,122.94 40.03,122.94 arc-90 40.52,122.46 40.52,121.64 arc90 40.74,121.42 40.97,121.42 arc90 41.2,121.64 41.2,122.46 arc-90 41.68,122.94 41.91,122.94 arc-90 42.39,122.46 42.39,121.64 arc90 42.62,121.42 42.85,121.42 arc90 43.08,121.64 43.08,122.46 arc-90 43.56,122.94 43.79,122.94 arc-90 44.27,122.46 44.27,122.41 arc90 44.5,122.18 66.18,122.18 66.89,122.89 66.89,122.95 67.04,123.1 | MOD1.6 113.7,155.04 113.29,155.46 105.09,155.46 87.94,138.3 82.24,138.3 67.04,123.1 | 67.04,123.1
ENET_D1_P
  Top 0.127: J5.4 18,122.05 25.7,122.05 26.36,122.7 U1.1 29.41,122.7 29.54,122.82 30.48,122.82 31.47,121.83 33.36,121.83 arc90 33.94,122.41 33.94,122.46 arc-90 34.16,122.69 34.39,122.69 arc-90 34.62,122.46 34.62,121.64 arc90 35.1,121.16 35.33,121.16 arc90 35.82,121.64 35.82,122.46 arc-90 36.04,122.69 36.27,122.69 arc-90 36.5,122.46 36.5,121.64 arc90 36.98,121.16 37.21,121.16 arc90 37.7,121.64 37.7,122.46 arc-90 37.92,122.69 38.15,122.69 arc-90 38.38,122.46 38.38,121.64 arc90 38.86,121.16 39.09,121.16 arc90 39.58,121.64 39.58,122.46 arc-90 39.8,122.69 40.03,122.69 arc-90 40.26,122.46 40.26,121.64 arc90 40.74,121.16 40.97,121.16 arc90 41.45,121.64 41.45,122.46 arc-90 41.68,122.69 41.91,122.69 arc-90 42.14,122.46 42.14,121.64 arc90 42.62,121.16 42.85,121.16 arc90 43.33,121.64 43.33,122.46 arc-90 43.56,122.69 43.79,122.69 arc-90 44.02,122.46 44.02,122.41 arc90 44.5,121.92 66.29,121.92 66.36,122 | MOD1.4 113.3,155.04 113.14,155.2 105.2,155.2 88.04,138.04 82.34,138.04 67.14,122.84 67.14,122.78 66.36,122 | 66.36,122
ENET_D2_N
  Top 0.127: J5.2 17.56,118.62 19.44,120.5 20.7,120.5 21.87,119.33 28.85,119.33 U2.4 29.71,119.35 29.81,119.45 37.12,119.45 37.29,119.28 arc90 37.78,118.8 38.03,118.8 arc90 38.52,119.28 38.52,119.7 arc-90 38.8,119.98 38.9,119.98 arc-90 39.22,119.66 39.22,119.6 39.22,119.28 arc90 39.71,118.8 39.96,118.8 arc90 40.45,119.28 40.45,120.06 arc-90 40.67,120.29 40.93,120.29 arc-90 41.16,120.06 41.16,119.28 arc90 41.64,118.8 41.9,118.8 arc90 42.38,119.28 42.38,120.06 arc-90 42.6,120.29 42.86,120.29 arc-90 43.09,120.06 43.09,119.28 arc90 43.57,118.8 43.83,118.8 arc90 44.31,119.28 44.31,120.06 arc-90 44.53,120.29 44.79,120.29 arc-90 45.02,120.06 45.02,120.03 arc90 45.5,119.54 66.24,119.54 82.84,136.14 89.14,136.14 105.9,152.9 114.1,152.9 114.5,152.5 MOD1.9
ENET_D2_P
  Top 0.127: J5.3 17.56,120.46 17.87,120.77 20.89,120.77 21.81,119.85 U2.5 37,119.85 arc-90 37.55,119.3 37.55,119.27 arc90 37.69,119.13 38.11,119.13 arc90 38.26,119.28 38.26,120.06 arc-90 38.51,120.32 39.23,120.32 arc-90 39.48,120.06 39.48,119.28 arc90 39.71,119.05 39.96,119.05 arc90 40.19,119.28 40.19,120.06 arc-90 40.67,120.55 40.93,120.55 arc-90 41.41,120.06 41.41,119.28 arc90 41.64,119.05 41.9,119.05 arc90 42.12,119.28 42.12,120.06 arc-90 42.6,120.55 42.86,120.55 arc-90 43.34,120.06 43.34,119.28 arc90 43.57,119.05 43.83,119.05 arc90 44.05,119.28 44.05,120.06 arc-90 44.53,120.55 44.79,120.55 arc-90 45.27,120.06 45.27,120.03 arc90 45.5,119.8 66.14,119.8 82.74,136.4 89.04,136.4 105.79,153.16 114.21,153.16 114.9,152.46 MOD1.11
ENET_D3_N
  Top 0.127: J5.9 21.19,118.35 U2.2 29.91,118.35 31.16,117.1 33.02,117.1 arc90 33.24,117.33 33.24,117.33 arc-90 33.73,117.81 34.35,117.81 arc-90 34.83,117.33 34.83,116.91 arc90 35.05,116.68 35.68,116.68 arc90 35.9,116.91 35.9,117.33 arc-90 36.39,117.81 37.01,117.81 arc-90 37.49,117.33 37.49,116.9 arc90 37.98,116.42 38.11,116.42 arc90 38.56,116.87 38.56,117.33 arc-90 39.05,117.81 39.67,117.81 arc-90 40.15,117.33 40.15,116.61 arc90 40.38,116.39 41,116.39 arc90 41.23,116.61 41.23,117.33 arc-90 41.71,117.81 42.33,117.81 arc-90 42.81,117.33 42.81,116.61 arc90 43.04,116.39 43.66,116.39 arc90 43.89,116.61 43.89,117.33 arc-90 44.37,117.81 44.99,117.81 arc-90 45.47,117.33 45.47,117.33 arc90 45.7,117.1 65.74,117.1 82.44,133.8 92.84,133.8 111.52,152.48 | 113.28,152.48 113.7,152.06 MOD1.5 | 113.28,152.48 | 113.28,152.48 113.21,152.56 111.59,152.56 111.52,152.48 | 111.52,152.48
ENET_D3_P
  Top 0.127: J5.8 20.8,117.41 21.25,117.85 U2.1 30.05,117.85 31.06,116.84 33.02,116.84 arc90 33.5,117.33 33.5,117.33 arc-90 33.73,117.56 34.35,117.56 arc-90 34.57,117.33 34.57,116.61 arc90 35.05,116.13 35.68,116.13 arc90 36.16,116.61 36.16,117.33 arc-90 36.39,117.56 37.01,117.56 arc-90 37.23,117.33 37.23,116.61 arc90 37.72,116.13 38.34,116.13 arc90 38.82,116.61 38.82,117.33 arc-90 39.05,117.56 39.67,117.56 arc-90 39.9,117.33 39.9,116.61 arc90 40.38,116.13 41,116.13 arc90 41.48,116.61 41.48,117.33 arc-90 41.71,117.56 42.33,117.56 arc-90 42.56,117.33 42.56,116.61 arc90 43.04,116.13 43.66,116.13 arc90 44.14,116.61 44.14,117.33 arc-90 44.37,117.56 44.99,117.56 arc-90 45.22,117.33 45.22,117.33 arc90 45.7,116.84 65.84,116.84 82.54,133.54 92.94,133.54 111.7,152.3 113.1,152.3 113.3,152.1 MOD1.3
ENET_SYNC_IN  (via drill 0.5)
  Top 0.2: MOD1.16 115.7,158.1 114.8,159 95,159 v84,148 | v70.3,147.5 55.9,147.5 v55.7,147.3 | v55.9,103.9 56.1,103.7 58.8,103.7 67.27,95.23 67.35,95.23 J4.8
  Bottom 0.2: v84,148 83.5,147.5 v70.3,147.5 | v55.7,147.3 55.7,104.18 v55.9,103.9
ENET_SYNC_OUT  (via drill 0.5)
  Top 0.2: MOD1.18 116.1,159.1 115.2,160 93.7,160 81.1,147.4 81.1,142.8 64.7,126.4 v64.7,126.1
  Bottom 0.2: v64.7,126.1 64.7,117 70.5,111.2 70.5,97.16 J4.9
GLOBAL_EN  (via drill 0.5)
  Top 0.2: U11.4 116.7,42.2 118,43.5 121.4,43.5 124.72,46.82 131.3,46.82 | 131.3,46.82 J2.3 | MOD1.99 132.5,127.7 v132.7,127.5 | v107.55,124 107.55,104.3 v107.45,104.2 107.5,104.15 107.5,92.4 106.6,91.5 106.6,71 109.9,67.7 126.1,67.7 130.1,63.7 130.1,48.02 131.3,46.82 | J4.14 69.17,102.57 70.9,104.3 102.3,104.3 v102.4,104.2
  Bottom 0.2: v107.55,124 107.75,124.2 127.45,124.2 130.75,127.5 v132.7,127.5 | v102.4,104.2 v107.45,104.2
GND  (via drill 0.35, 0.5)